# EAGLE design Logic (EAGLE 6.4)

## Sheet 1 of 9: Power Supply
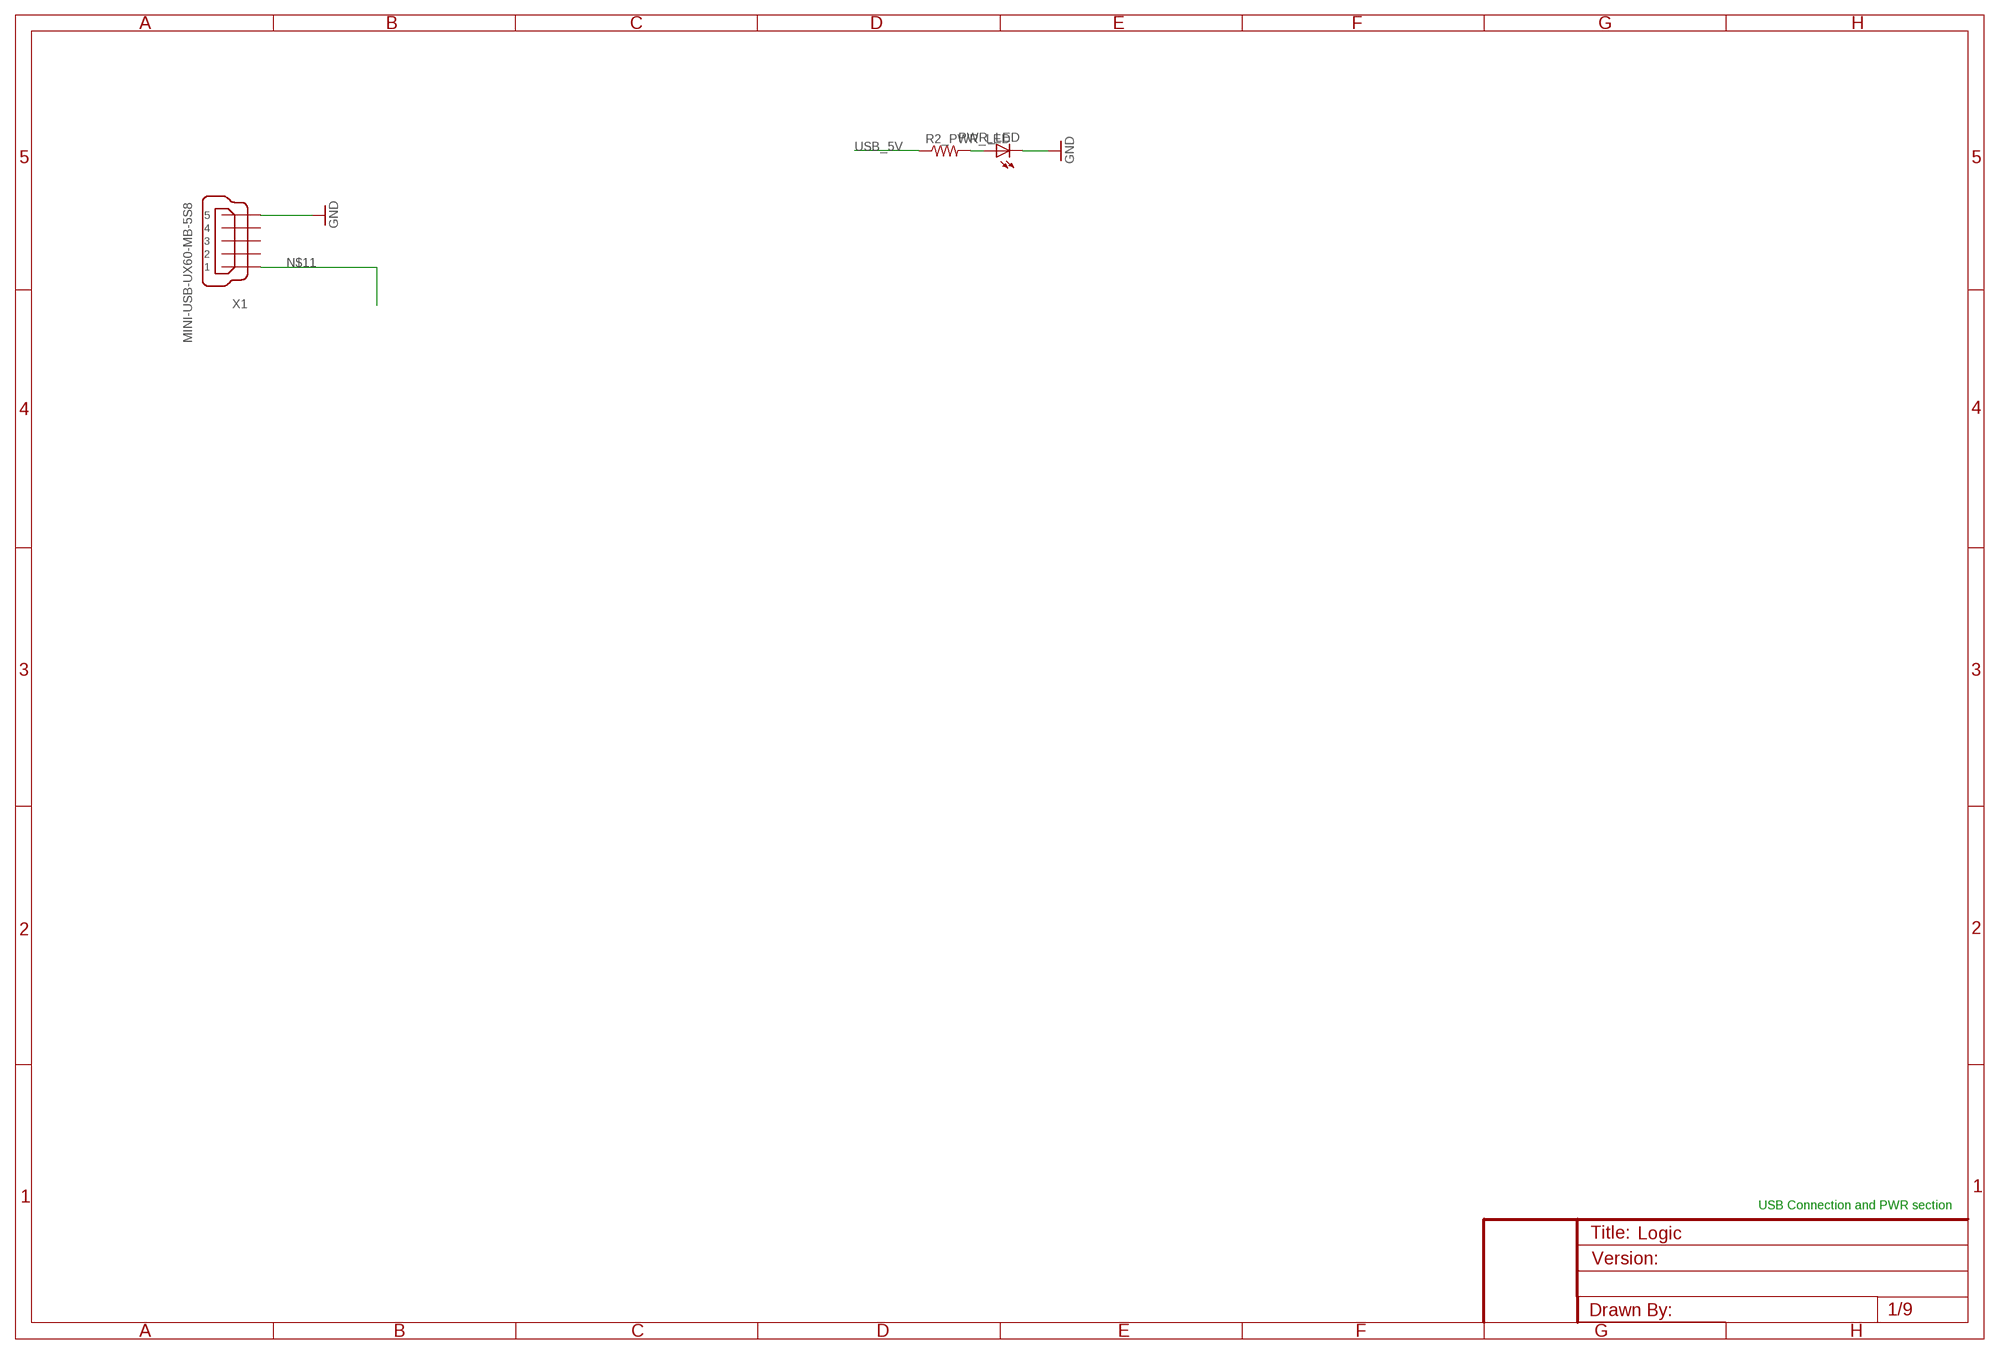
[diagram p0: schematic, sheet 1]

### Parts
PWR_LED  LEDCHIP-LED0603  [CHIP-LED0603]
R2_PWR_LED  RESISTOR0402-RES  [0402-RES]
X1  MINI-USB-UX60-MB-5S8  [UX60-MB-5S8]

### Nets
GND: PWR_LED.C X1.5 ; also sheet 2,4
N$1: PWR_LED.A R2_PWR_LED.2
N$11: X1.1
USB_5V: R2_PWR_LED.1
Unconnected: X1.2 X1.3 X1.4

### Notes on the sheet
- USB Connection and PWR section

## Sheet 2 of 9: STM32F439IIT
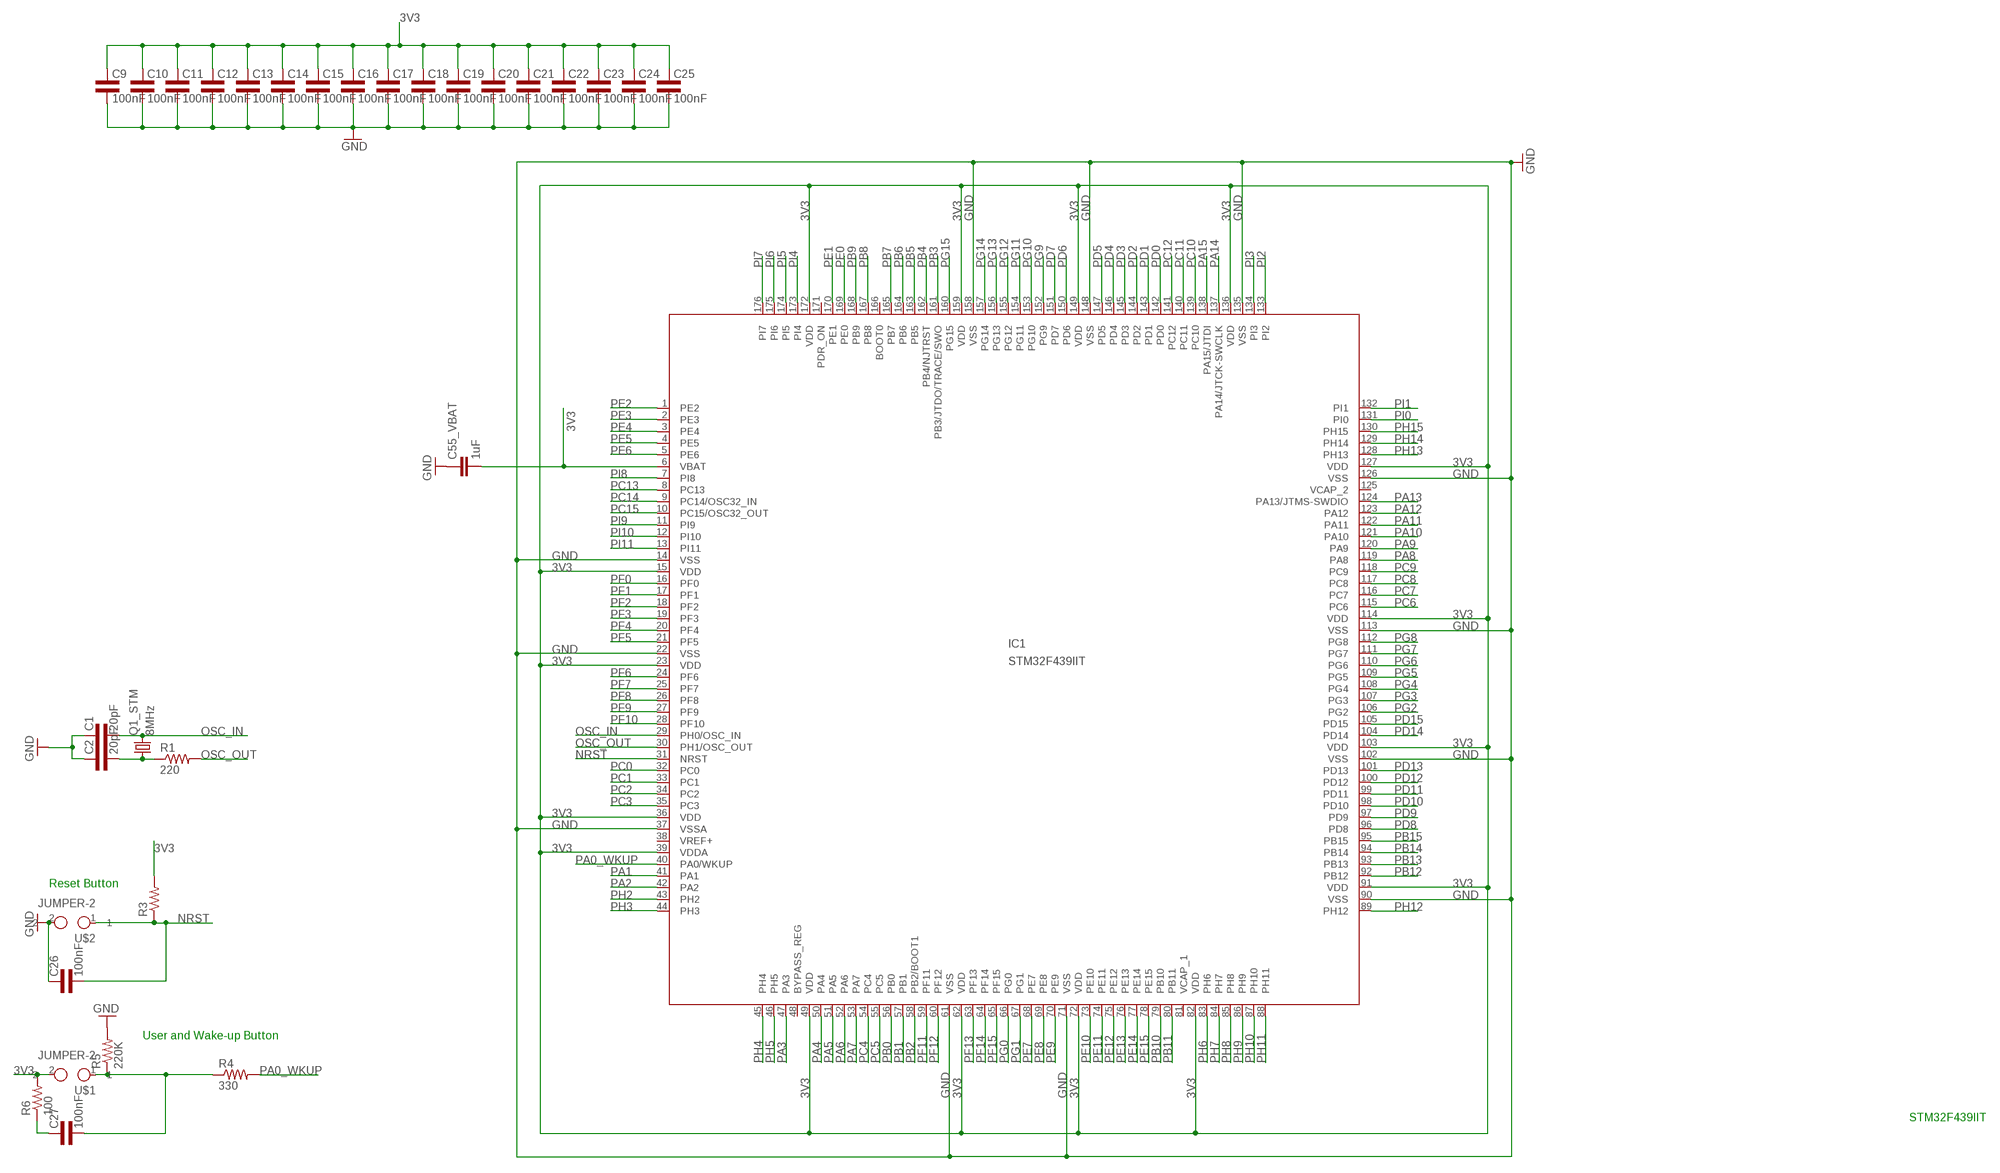
[diagram p1: schematic, sheet 2]

### Parts
C1  20pF  CAP0402L3  [0402L3]
C2  20pF  CAP0402L3  [0402L3]
C9  100nF  CAP0402L3  [0402L3]
C10  100nF  CAP0402L3  [0402L3]
C11  100nF  CAP0402L3  [0402L3]
C12  100nF  CAP0402L3  [0402L3]
C13  100nF  CAP0402L3  [0402L3]
C14  100nF  CAP0402L3  [0402L3]
C15  100nF  CAP0402L3  [0402L3]
C16  100nF  CAP0402L3  [0402L3]
C17  100nF  CAP0402L3  [0402L3]
C18  100nF  CAP0402L3  [0402L3]
C19  100nF  CAP0402L3  [0402L3]
C20  100nF  CAP0402L3  [0402L3]
C21  100nF  CAP0402L3  [0402L3]
C22  100nF  CAP0402L3  [0402L3]
C23  100nF  CAP0402L3  [0402L3]
C24  100nF  CAP0402L3  [0402L3]
C25  100nF  CAP0402L3  [0402L3]
C26  100nF  CAP0402L3  [0402L3]
C27  100nF  CAP0402L3  [0402L3]
C55_VBAT  1uF  C-EUC0402  [C0402]
IC1  STM32F439IIT  [LQFP-176]
Q1_STM  8MHz  CRYSTALCTS406  [CTS406]
R1  220  RESISTOR0402-RES  [0402-RES]
R3  RESISTOR0402-RES  [0402-RES]
R4  330  RESISTOR0402-RES  [0402-RES]
R5  220K  RESISTOR0402-RES  [0402-RES]
R6  100  RESISTOR0402-RES  [0402-RES]
U$1  JUMPER-2  [1X02]
U$2  JUMPER-2  [1X02]

### Nets
3V3: C9.P$1 C10.P$1 C11.P$1 C12.P$1 C13.P$1 C14.P$1 C15.P$1 C16.P$1 C17.P$1 C18.P$1 C19.P$1 C20.P$1 C21.P$1 C22.P$1 C23.P$1 C24.P$1 C25.P$1 C55_VBAT.2 IC1.6(VBAT) IC1.15(VDD) IC1.23(VDD) IC1.36(VDD) IC1.39(VDDA) IC1.49(VDD) IC1.62(VDD) IC1.72(VDD) IC1.82(VDD) IC1.91(VDD) IC1.103(VDD) IC1.114(VDD) IC1.127(VDD) IC1.136(VDD) IC1.149(VDD) IC1.159(VDD) IC1.172(VDD) R3.2 R6.2 U$1.2 ; also sheet 4
GND: C1.P$1 C2.P$1 C9.P$2 C10.P$2 C11.P$2 C12.P$2 C13.P$2 C14.P$2 C15.P$2 C16.P$2 C17.P$2 C18.P$2 C19.P$2 C20.P$2 C21.P$2 C22.P$2 C23.P$2 C24.P$2 C25.P$2 C26.P$1 C55_VBAT.1 IC1.14(VSS) IC1.22(VSS) IC1.37(VSSA) IC1.61(VSS) IC1.71(VSS) IC1.90(VSS) IC1.102(VSS) IC1.113(VSS) IC1.126(VSS) IC1.135(VSS) IC1.148(VSS) IC1.158(VSS) R5.2 U$2.2 ; also sheet 1,4
N$2: C2.P$2 Q1_STM.1 R1.1
N$3: C27.P$2 R4.1 R5.1 U$1.1
N$4: C27.P$1 R6.1
NRST: C26.P$2 IC1.31(NRST) R3.1 U$2.1
OSC_IN: C1.P$2 IC1.29(PH0/OSC_IN) Q1_STM.3
OSC_OUT: IC1.30(PH1/OSC_OUT) R1.2
PA0_WKUP: IC1.40(PA0/WKUP) R4.2
PA1: IC1.41(PA1)
PA2: IC1.42(PA2)
PA3: IC1.47(PA3)
PA4: IC1.50(PA4)
PA5: IC1.51(PA5)
PA6: IC1.52(PA6)
PA7: IC1.53(PA7)
PA8: IC1.119(PA8)
PA9: IC1.120(PA9)
PA10: IC1.121(PA10)
PA11: IC1.122(PA11)
PA12: IC1.123(PA12)
PA13: IC1.124(PA13/JTMS-SWDIO)
PA14: IC1.137(PA14/JTCK-SWCLK)
PA15: IC1.138(PA15/JTDI)
PB0: IC1.56(PB0)
PB1: IC1.57(PB1)
PB2: IC1.58(PB2/BOOT1)
PB3: IC1.161(PB3/JTDO/TRACE/SWO)
PB4: IC1.162(PB4/NJTRST)
PB5: IC1.163(PB5) ; also sheet 4
PB6: IC1.164(PB6) ; also sheet 4
PB7: IC1.165(PB7)
PB8: IC1.167(PB8)
PB9: IC1.168(PB9)
PB10: IC1.79(PB10)
PB11: IC1.80(PB11)
PB12: IC1.92(PB12)
PB13: IC1.93(PB13)
PB14: IC1.94(PB14)
PB15: IC1.95(PB15)
PC0: IC1.32(PC0) ; also sheet 4
PC1: IC1.33(PC1)
PC2: IC1.34(PC2)
PC3: IC1.35(PC3)
PC4: IC1.54(PC4)
PC5: IC1.55(PC5)
PC6: IC1.115(PC6)
PC7: IC1.116(PC7)
PC8: IC1.117(PC8)
PC9: IC1.118(PC9)
PC10: IC1.139(PC10)
PC11: IC1.140(PC11)
PC12: IC1.141(PC12)
PC13: IC1.8(PC13)
PC14: IC1.9(PC14/OSC32_IN)
PC15: IC1.10(PC15/OSC32_OUT)
PD0: IC1.142(PD0) ; also sheet 4
PD1: IC1.143(PD1) ; also sheet 4
PD2: IC1.144(PD2)
PD3: IC1.145(PD3)
PD4: IC1.146(PD4)
PD5: IC1.147(PD5)
PD6: IC1.150(PD6)
PD7: IC1.151(PD7)
PD8: IC1.96(PD8) ; also sheet 4
PD9: IC1.97(PD9) ; also sheet 4
PD10: IC1.98(PD10) ; also sheet 4
PD11: IC1.99(PD11)
PD12: IC1.100(PD12)
PD13: IC1.101(PD13)
PD14: IC1.104(PD14) ; also sheet 4
PD15: IC1.105(PD15) ; also sheet 4
PE0: IC1.169(PE0) ; also sheet 4
PE1: IC1.170(PE1) ; also sheet 4
PE2: IC1.1(PE2)
PE3: IC1.2(PE3)
PE4: IC1.3(PE4)
PE5: IC1.4(PE5)
PE6: IC1.5(PE6)
PE7: IC1.68(PE7) ; also sheet 4
PE8: IC1.69(PE8) ; also sheet 4
PE9: IC1.70(PE9) ; also sheet 4
PE10: IC1.73(PE10) ; also sheet 4
PE11: IC1.74(PE11) ; also sheet 4
PE12: IC1.75(PE12) ; also sheet 4
PE13: IC1.76(PE13) ; also sheet 4
PE14: IC1.77(PE14) ; also sheet 4
PE15: IC1.78(PE15) ; also sheet 4
PF0: IC1.16(PF0) ; also sheet 4
PF1: IC1.17(PF1) ; also sheet 4
PF2: IC1.18(PF2) ; also sheet 4
PF3: IC1.19(PF3) ; also sheet 4
PF4: IC1.20(PF4) ; also sheet 4
PF5: IC1.21(PF5) ; also sheet 4
PF6: IC1.24(PF6)
PF7: IC1.25(PF7)
PF8: IC1.26(PF8)
PF9: IC1.27(PF9)
PF10: IC1.28(PF10)
PF11: IC1.59(PF11) ; also sheet 4
PF12: IC1.60(PF12) ; also sheet 4
PF13: IC1.63(PF13) ; also sheet 4
PF14: IC1.64(PF14) ; also sheet 4
PF15: IC1.65(PF15) ; also sheet 4
PG0: IC1.66(PG0) ; also sheet 4
PG1: IC1.67(PG1) ; also sheet 4
PG2: IC1.106(PG2)
PG3: IC1.107(PG3)
PG4: IC1.108(PG4) ; also sheet 4
PG5: IC1.109(PG5) ; also sheet 4
PG6: IC1.110(PG6)
PG7: IC1.111(PG7)
PG8: IC1.112(PG8) ; also sheet 4
PG9: IC1.152(PG9)
PG10: IC1.153(PG10)
PG11: IC1.154(PG11)
PG12: IC1.155(PG12)
PG13: IC1.156(PG13)
PG14: IC1.157(PG14)
PG15: IC1.160(PG15) ; also sheet 4
PH2: IC1.43(PH2)
PH3: IC1.44(PH3)
PH4: IC1.45(PH4)
PH5: IC1.46(PH5)
PH6: IC1.83(PH6)
PH7: IC1.84(PH7)
PH8: IC1.85(PH8)
PH9: IC1.86(PH9)
PH10: IC1.87(PH10)
PH11: IC1.88(PH11)
PH12: IC1.89(PH12)
PH13: IC1.128(PH13)
PH14: IC1.129(PH14)
PH15: IC1.130(PH15)
PI0: IC1.131(PI0)
PI1: IC1.132(PI1)
PI2: IC1.133(PI2)
PI3: IC1.134(PI3)
PI4: IC1.173(PI4)
PI5: IC1.174(PI5)
PI6: IC1.175(PI6)
PI7: IC1.176(PI7)
PI8: IC1.7(PI8)
PI9: IC1.11(PI9)
PI10: IC1.12(PI10)
PI11: IC1.13(PI11)
Unconnected: IC1.48(BYPASS_REG) IC1.166(BOOT0)

### Notes on the sheet
- Reset Button
- User and Wake-up Button
- STM32F439IIT

## Sheet 3 of 9: Header Pins
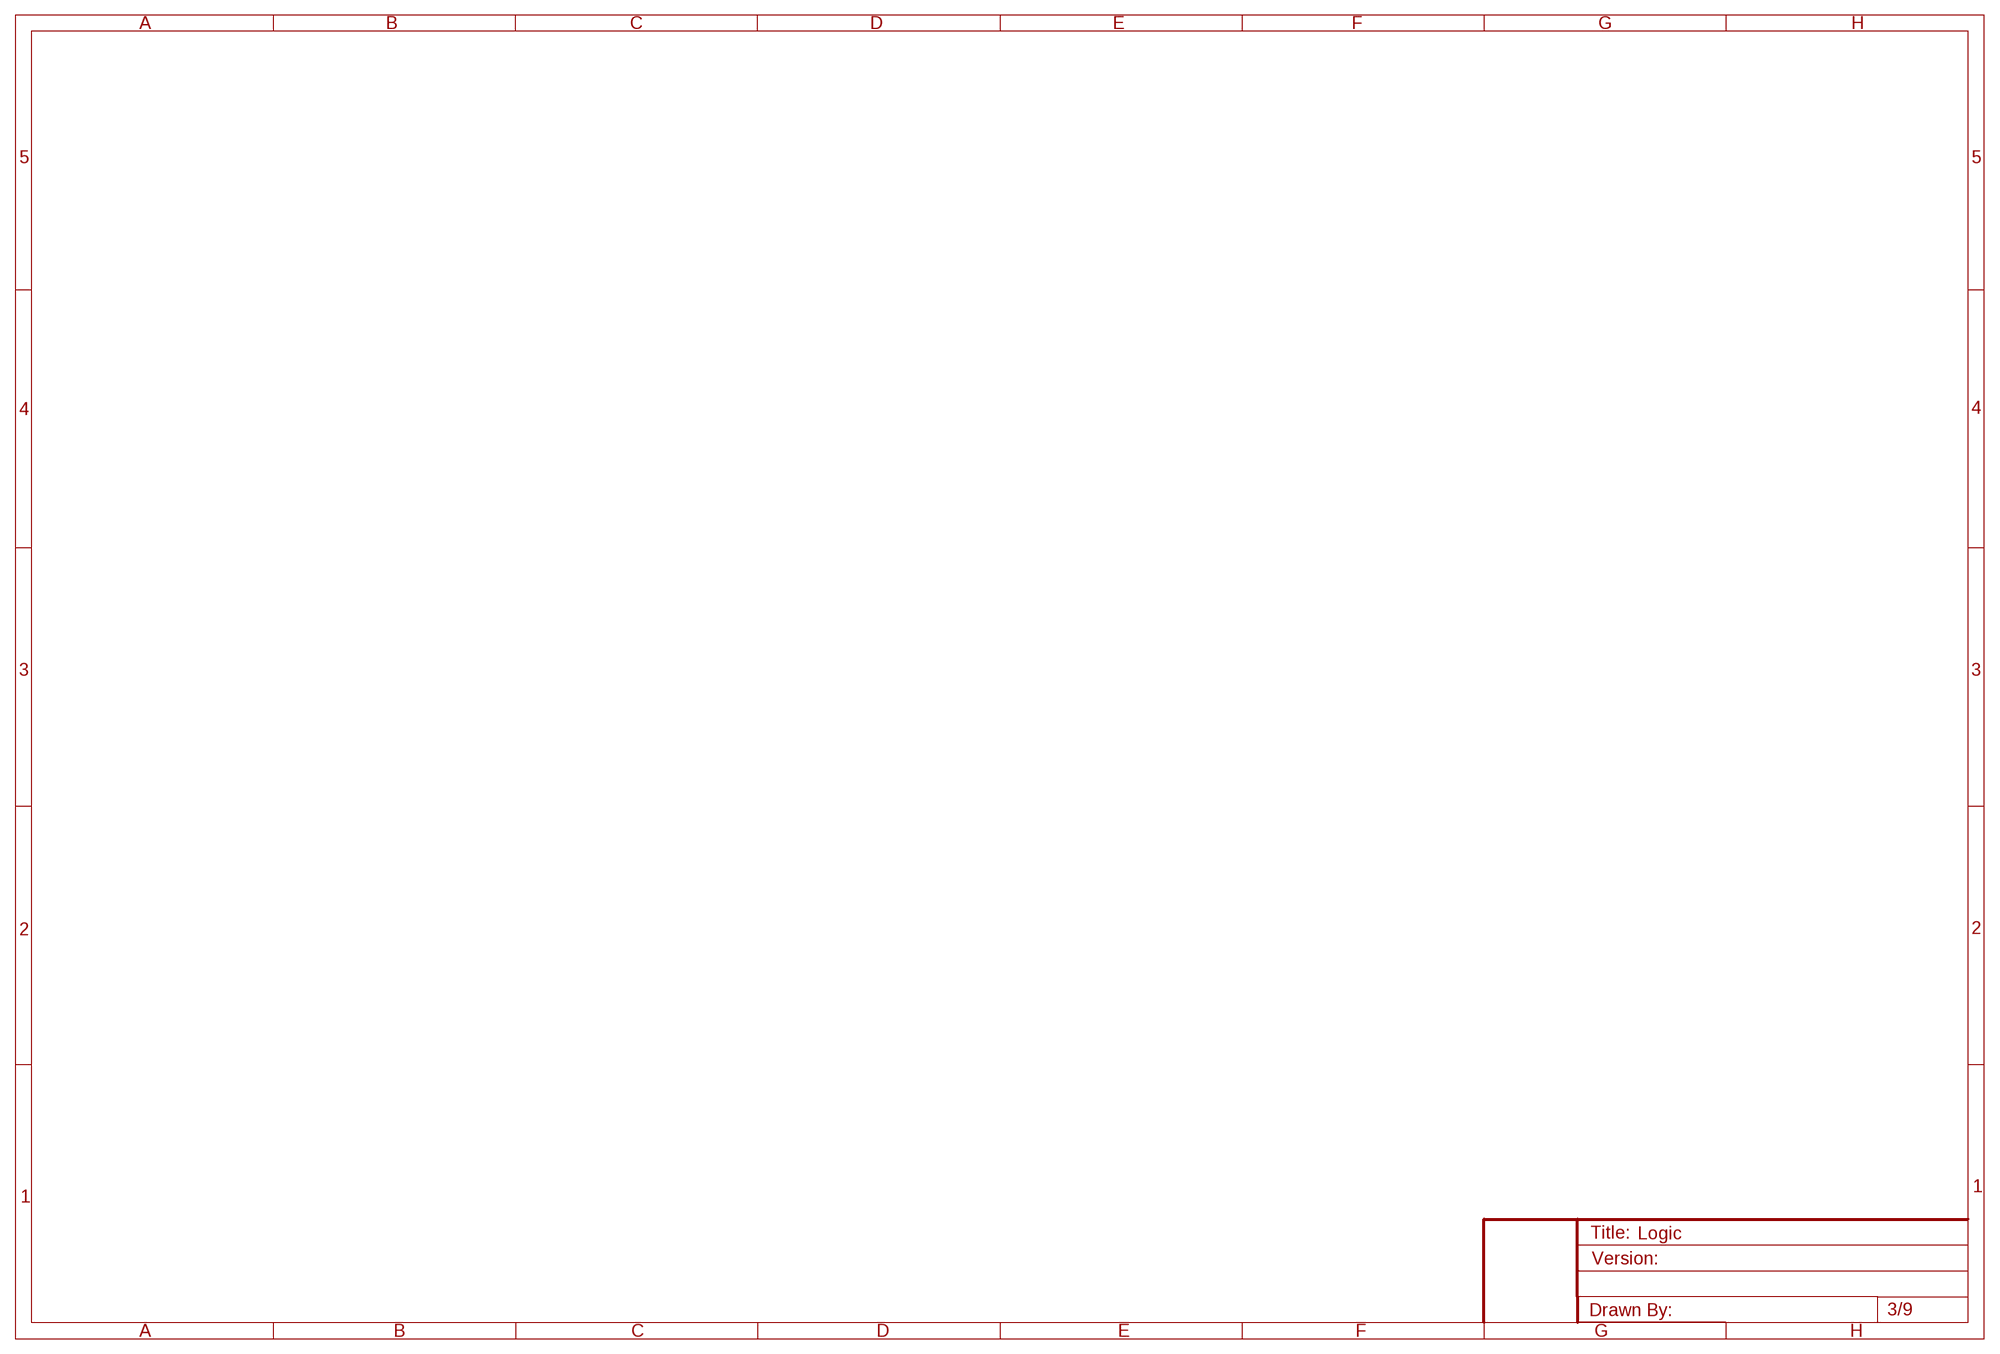
[diagram p2: schematic, sheet 3]

## Sheet 4 of 9: SRAM
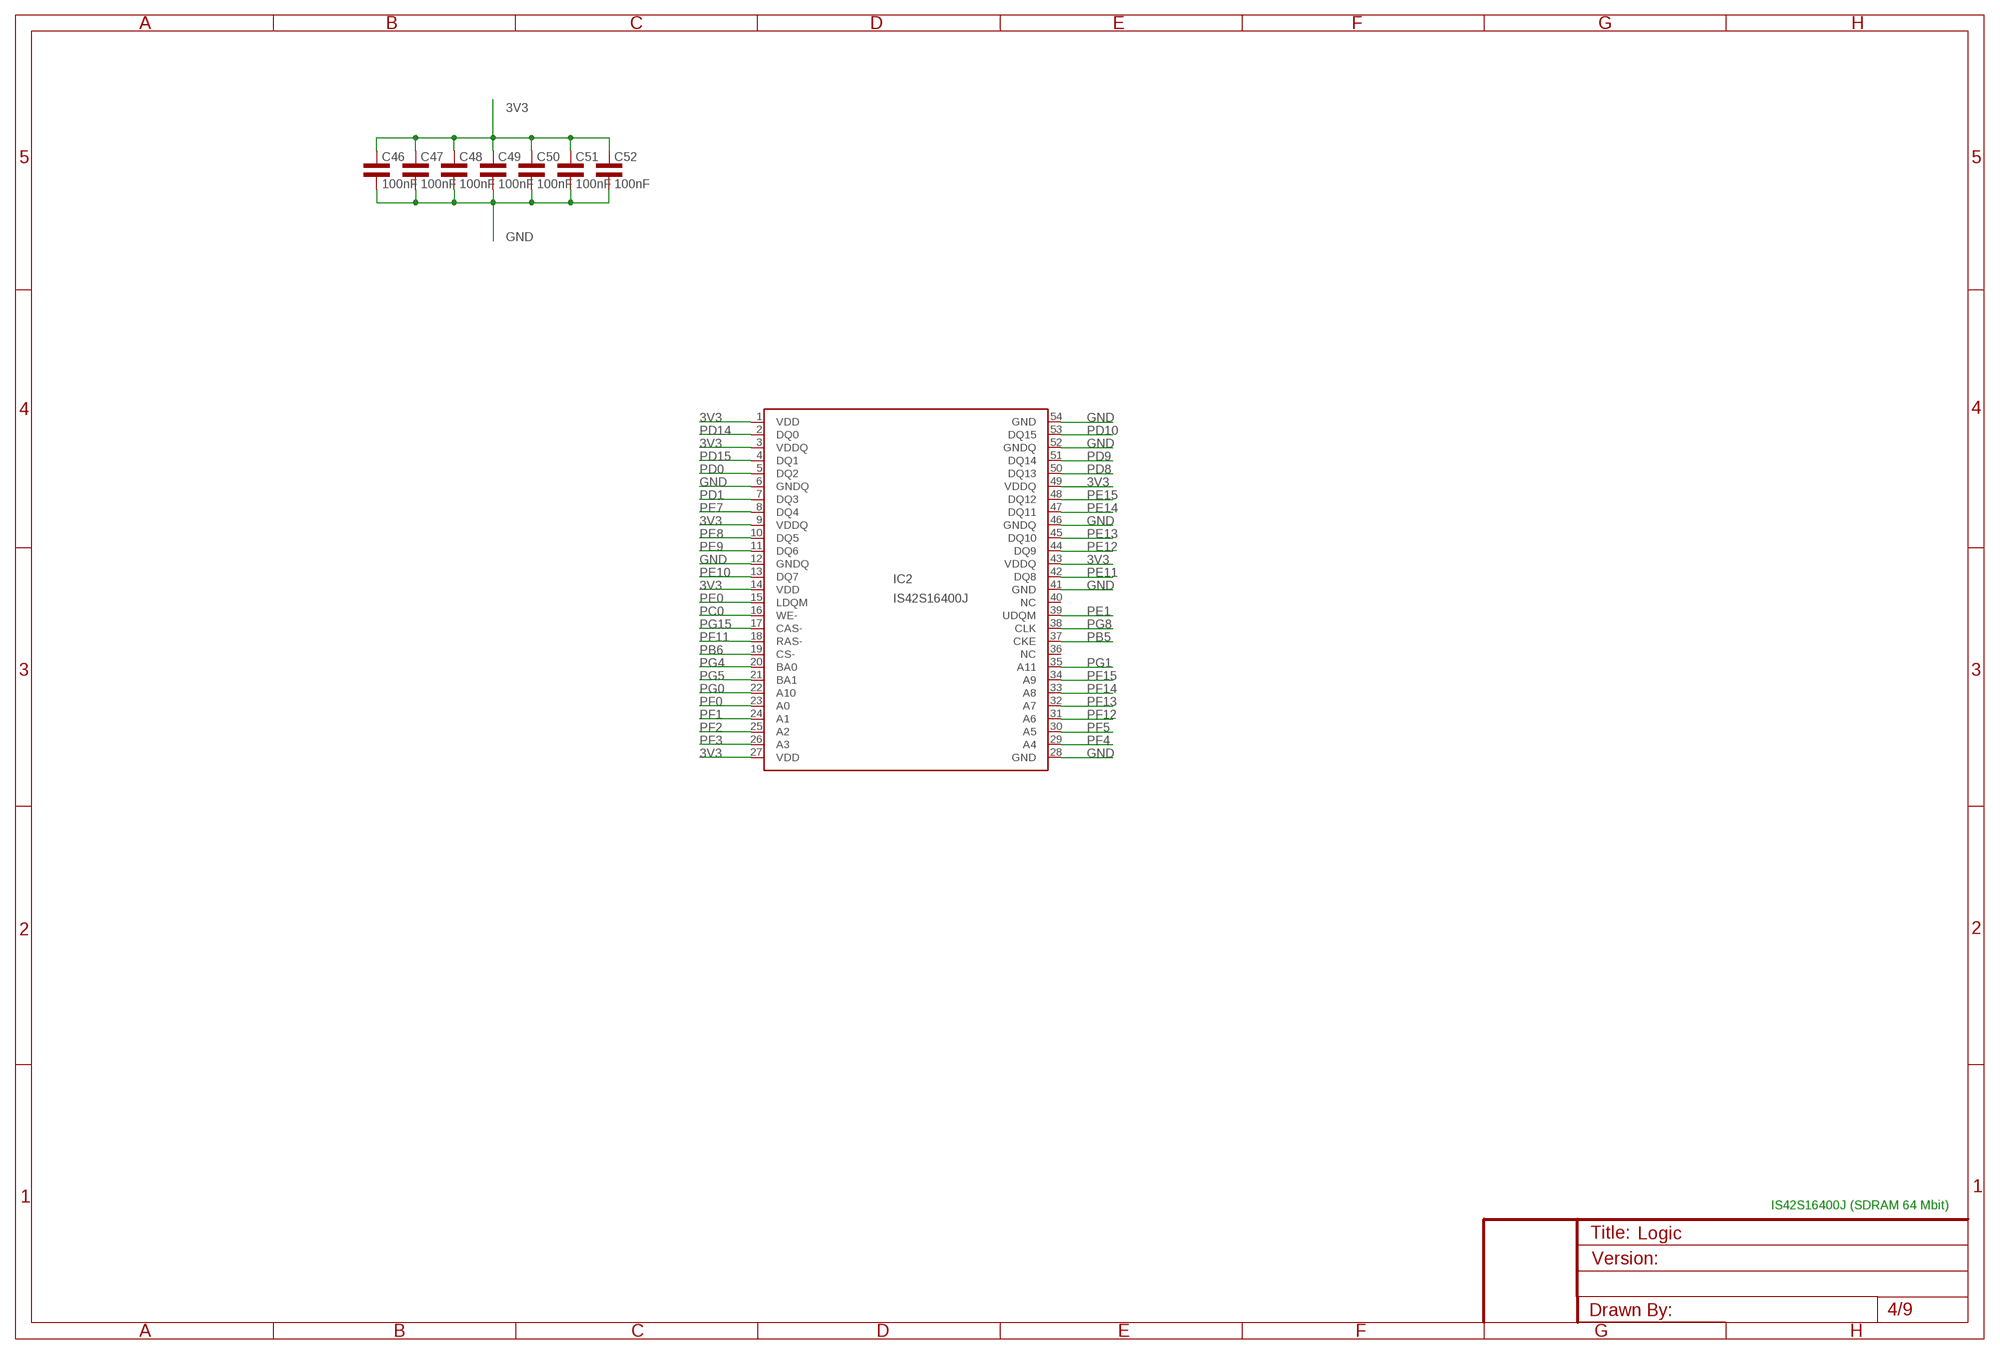
[diagram p3: schematic, sheet 4]

### Parts
C46  100nF  CAP0402L3  [0402L3]
C47  100nF  CAP0402L3  [0402L3]
C48  100nF  CAP0402L3  [0402L3]
C49  100nF  CAP0402L3  [0402L3]
C50  100nF  CAP0402L3  [0402L3]
C51  100nF  CAP0402L3  [0402L3]
C52  100nF  CAP0402L3  [0402L3]
IC2  IS42S16400J  [TSOP-2]

### Nets
3V3: C46.P$1 C47.P$1 C48.P$1 C49.P$1 C50.P$1 C51.P$1 C52.P$1 IC2.1(VDD) IC2.3(VDDQ) IC2.9(VDDQ) IC2.14(VDD) IC2.27(VDD) IC2.43(VDDQ) IC2.49(VDDQ) ; also sheet 2
GND: C46.P$2 C47.P$2 C48.P$2 C49.P$2 C50.P$2 C51.P$2 C52.P$2 IC2.6(GNDQ) IC2.12(GNDQ) IC2.28(GND) IC2.41(GND) IC2.46(GNDQ) IC2.52(GNDQ) IC2.54(GND) ; also sheet 1,2
PB5: IC2.37(CKE) ; also sheet 2
PB6: IC2.19(CS-) ; also sheet 2
PC0: IC2.16(WE-) ; also sheet 2
PD0: IC2.5(DQ2) ; also sheet 2
PD1: IC2.7(DQ3) ; also sheet 2
PD8: IC2.50(DQ13) ; also sheet 2
PD9: IC2.51(DQ14) ; also sheet 2
PD10: IC2.53(DQ15) ; also sheet 2
PD14: IC2.2(DQ0) ; also sheet 2
PD15: IC2.4(DQ1) ; also sheet 2
PE0: IC2.15(LDQM) ; also sheet 2
PE1: IC2.39(UDQM) ; also sheet 2
PE7: IC2.8(DQ4) ; also sheet 2
PE8: IC2.10(DQ5) ; also sheet 2
PE9: IC2.11(DQ6) ; also sheet 2
PE10: IC2.13(DQ7) ; also sheet 2
PE11: IC2.42(DQ8) ; also sheet 2
PE12: IC2.44(DQ9) ; also sheet 2
PE13: IC2.45(DQ10) ; also sheet 2
PE14: IC2.47(DQ11) ; also sheet 2
PE15: IC2.48(DQ12) ; also sheet 2
PF0: IC2.23(A0) ; also sheet 2
PF1: IC2.24(A1) ; also sheet 2
PF2: IC2.25(A2) ; also sheet 2
PF3: IC2.26(A3) ; also sheet 2
PF4: IC2.29(A4) ; also sheet 2
PF5: IC2.30(A5) ; also sheet 2
PF11: IC2.18(RAS-) ; also sheet 2
PF12: IC2.31(A6) ; also sheet 2
PF13: IC2.32(A7) ; also sheet 2
PF14: IC2.33(A8) ; also sheet 2
PF15: IC2.34(A9) ; also sheet 2
PG0: IC2.22(A10) ; also sheet 2
PG1: IC2.35(A11) ; also sheet 2
PG4: IC2.20(BA0) ; also sheet 2
PG5: IC2.21(BA1) ; also sheet 2
PG8: IC2.38(CLK) ; also sheet 2
PG15: IC2.17(CAS-) ; also sheet 2
Unconnected: IC2.36(NC) IC2.40(NC)

### Notes on the sheet
- IS42S16400J (SDRAM 64 Mbit)

## Sheet 5 of 9: TFT & Touch
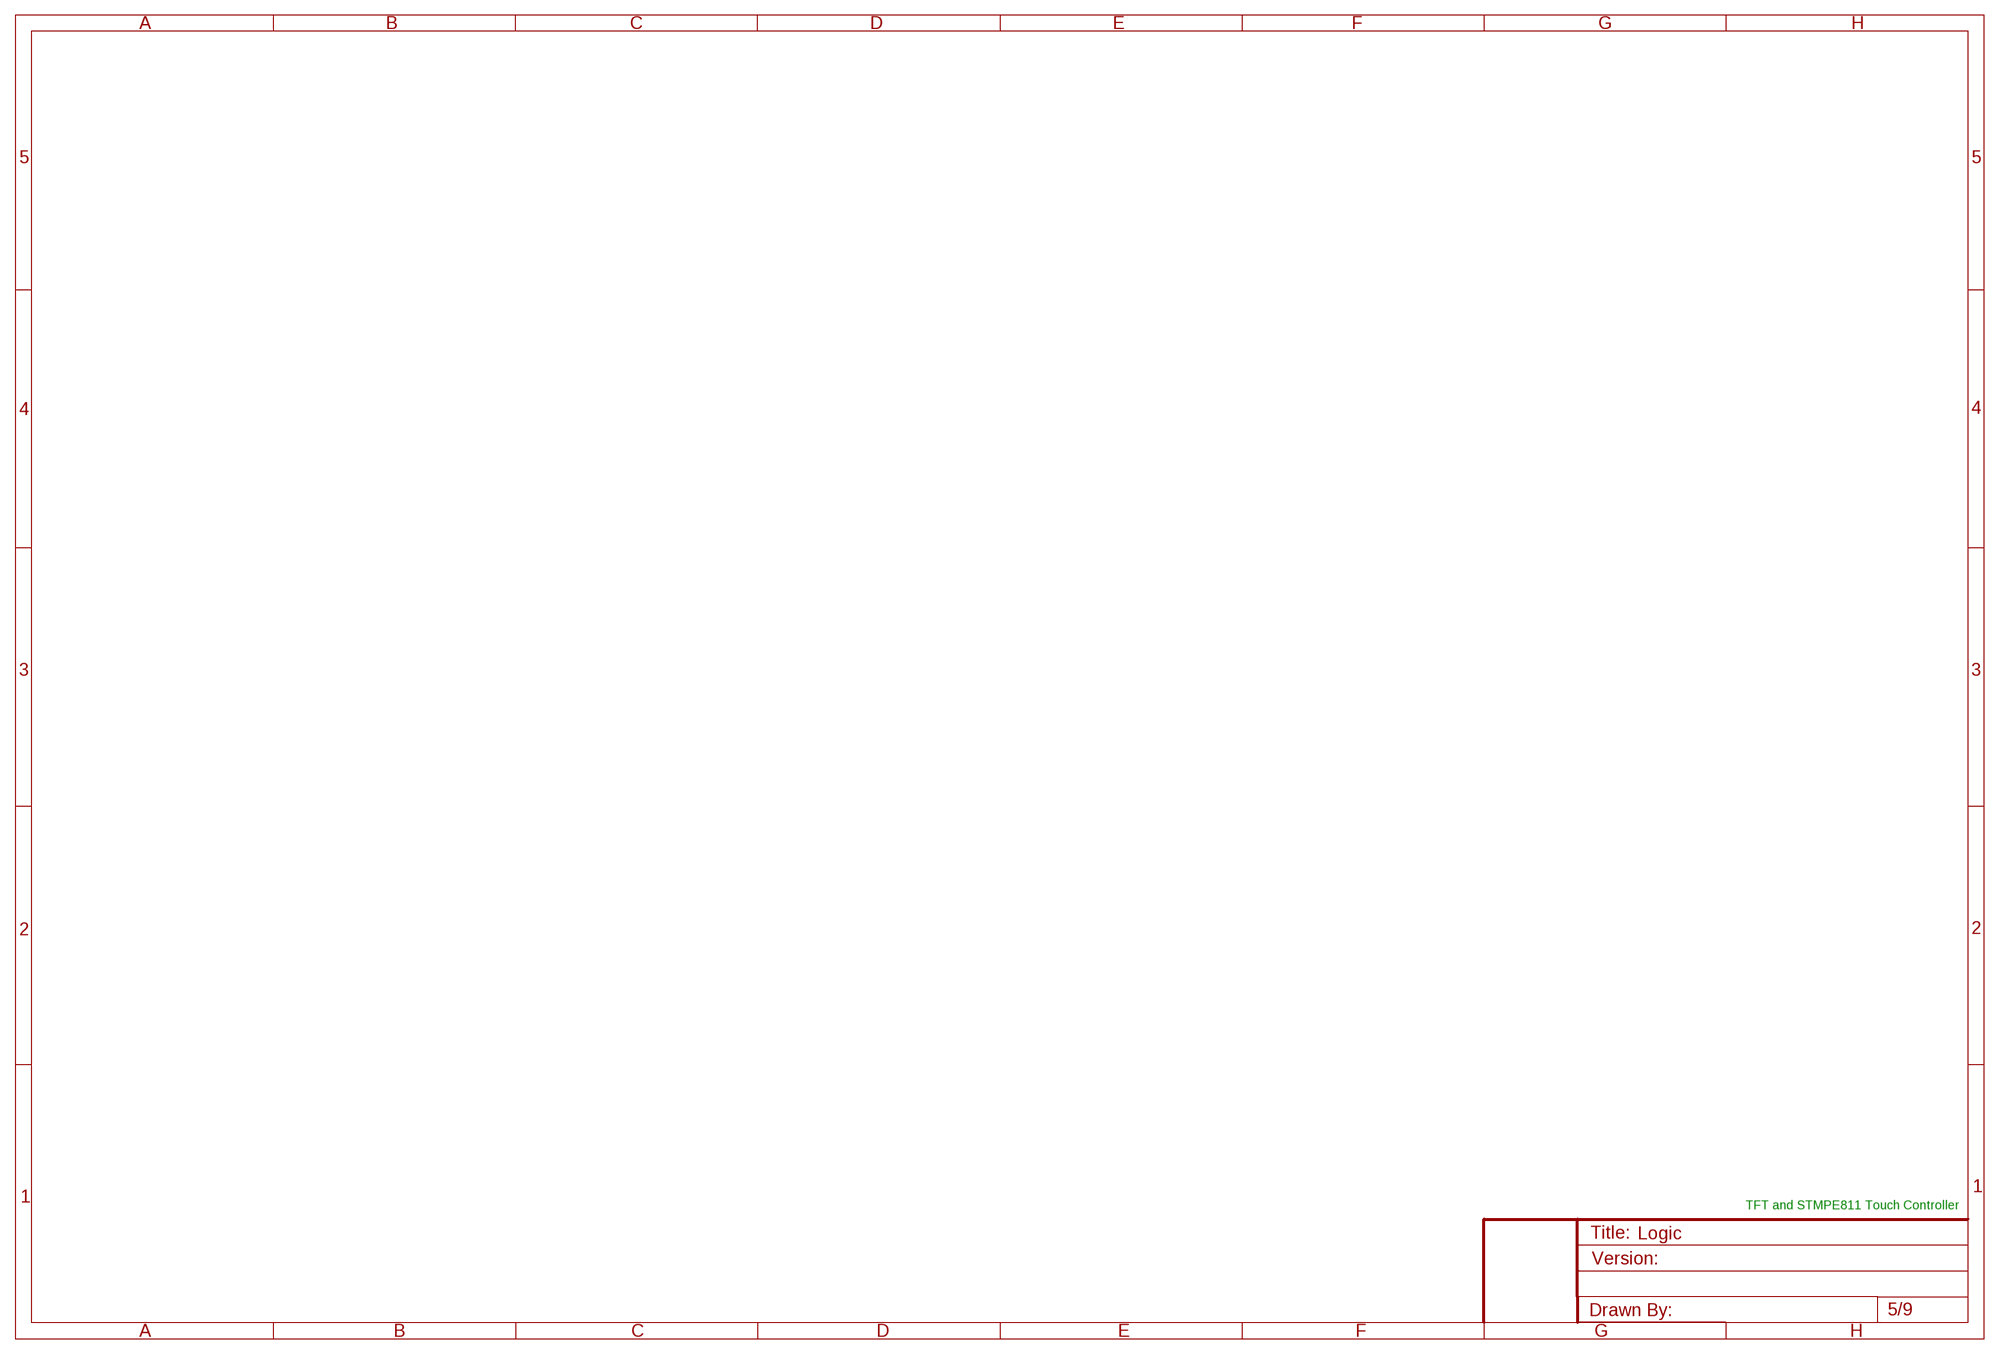
[diagram p4: schematic, sheet 5]

### Notes on the sheet
- TFT and STMPE811 Touch Controller

## Sheet 6 of 9: MP3 Codec
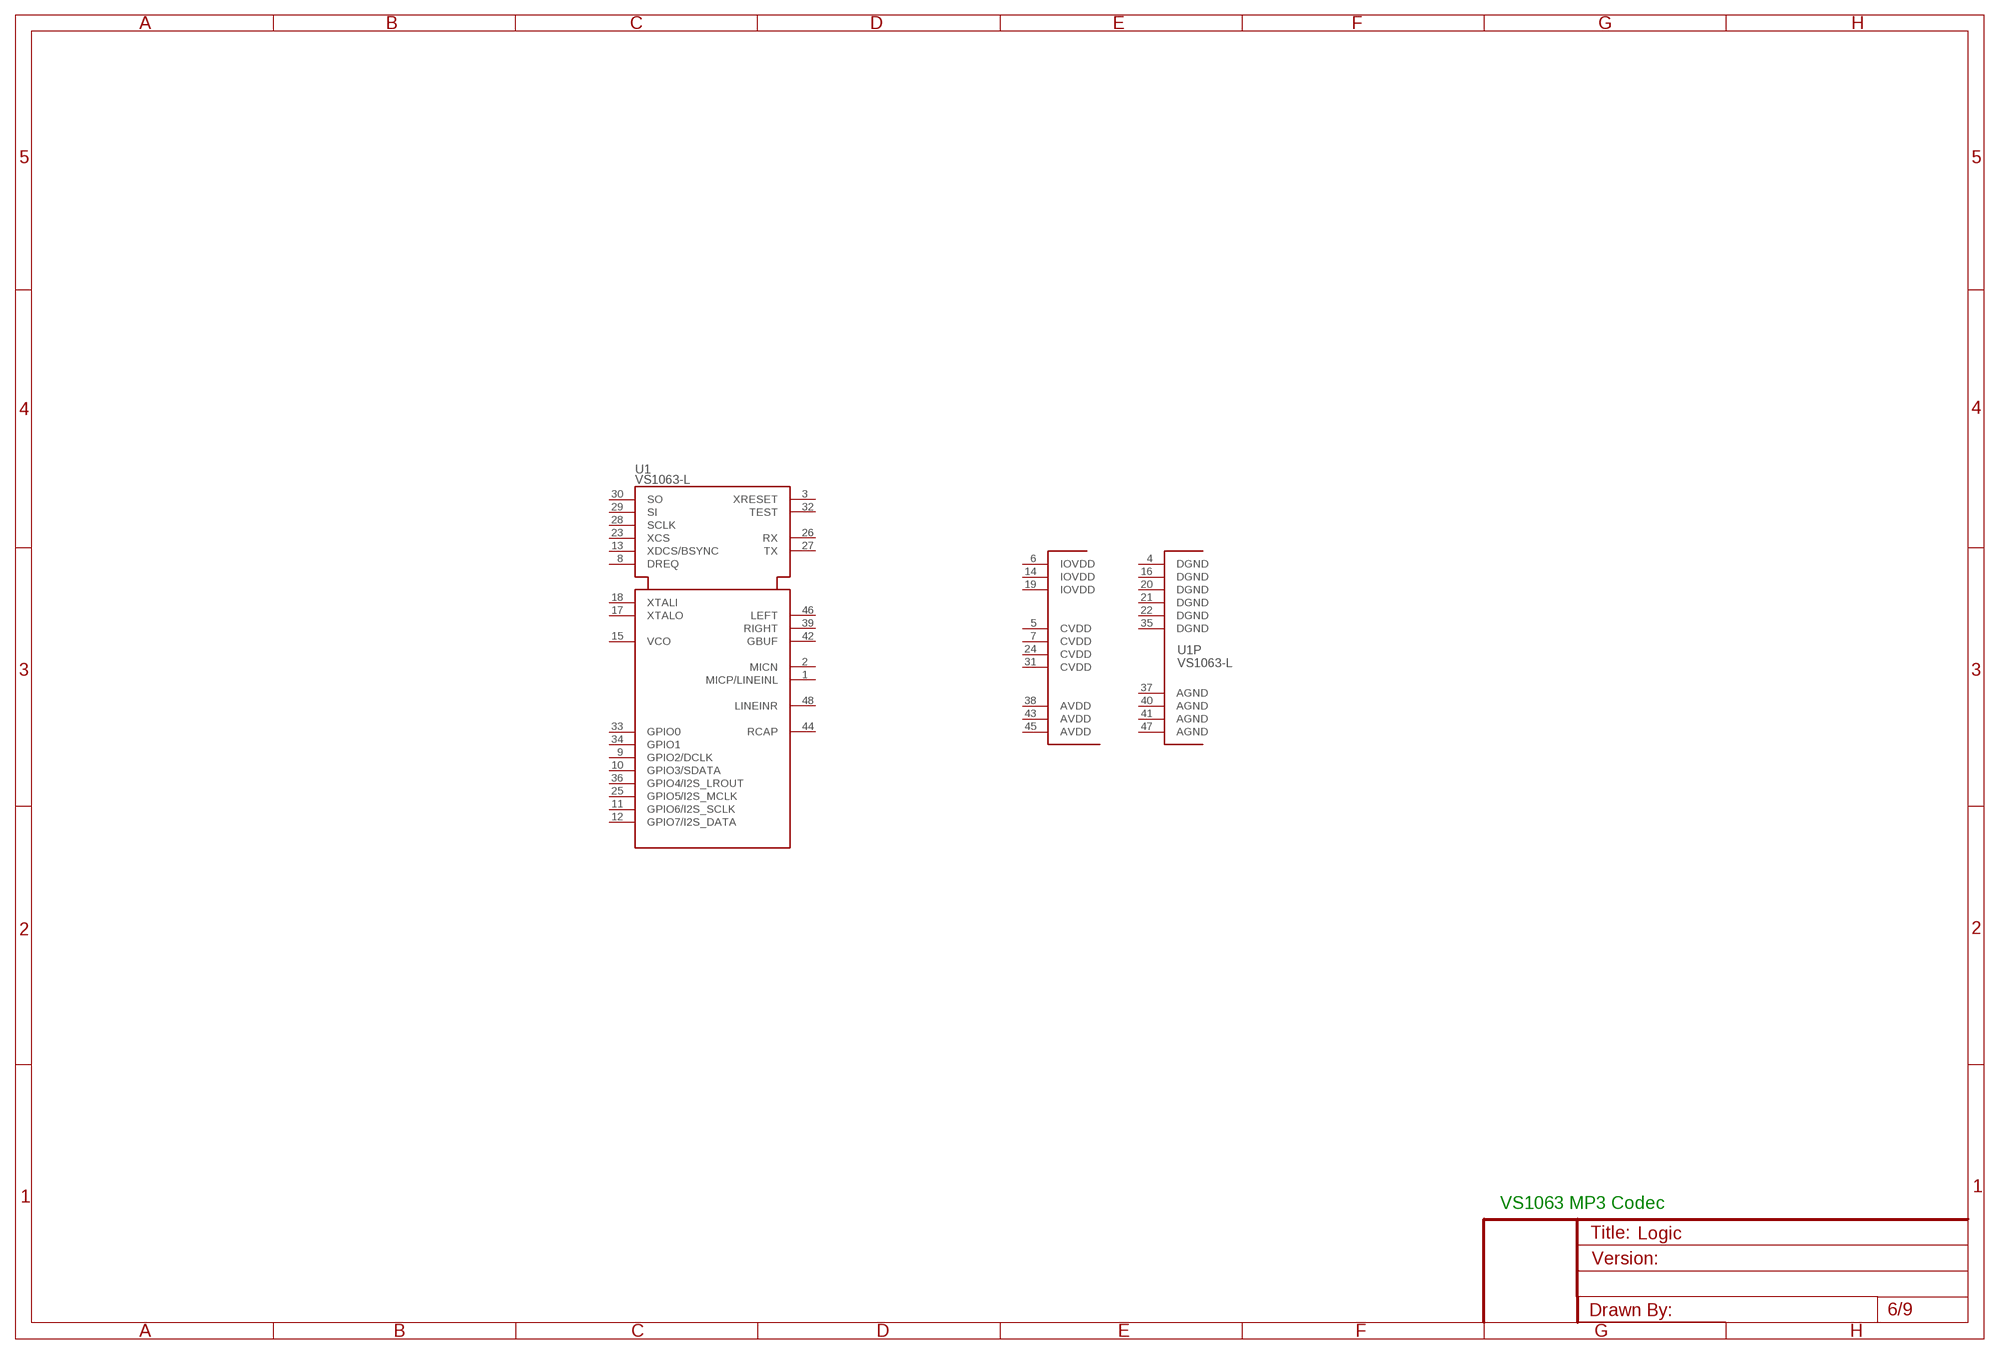
[diagram p5: schematic, sheet 6]

### Parts
U1  VS1063-L  [LQFP48]
Unconnected: U1.1(MICP/LINEINL) U1.2(MICN) U1.3(XRESET) U1.8(DREQ) U1.9(GPIO2/DCLK) U1.10(GPIO3/SDATA) U1.11(GPIO6/I2S_SCLK) U1.12(GPIO7/I2S_DATA) U1.13(XDCS/BSYNC) U1.15(VCO) U1.17(XTALO) U1.18(XTALI) U1.23(XCS) U1.25(GPIO5/I2S_MCLK) U1.26(RX) U1.27(TX) U1.28(SCLK) U1.29(SI) U1.30(SO) U1.32(TEST) U1.33(GPIO0) U1.34(GPIO1) U1.36(GPIO4/I2S_LROUT) U1.39(RIGHT) U1.42(GBUF) U1.44(RCAP) U1.46(LEFT) U1.48(LINEINR)

### Notes on the sheet
- VS1063 MP3 Codec

## Sheet 7 of 9: USB to PCM

## Sheet 8 of 9: DAC

## Sheet 9 of 9

## Power pins joined to a net without a drawn wire
AGND: U1.37(AGND) U1.40(AGND) U1.41(AGND) U1.47(AGND)
AVDD: U1.38(AVDD) U1.43(AVDD) U1.45(AVDD)
CVDD: U1.5(CVDD) U1.7(CVDD) U1.24(CVDD) U1.31(CVDD)
DGND: U1.4(DGND) U1.16(DGND) U1.20(DGND) U1.21(DGND) U1.22(DGND) U1.35(DGND)
IOVDD: U1.6(IOVDD) U1.14(IOVDD) U1.19(IOVDD)
PDR_ON: IC1.171(PDR_ON)
VCAP_1: IC1.81(VCAP_1)
VCAP_2: IC1.125(VCAP_2)
VREF+: IC1.38(VREF+)

## Library data of the parts
C1 C2 C9-C27 C46-C52 = common:CAP
C55_VBAT = rcl:C-EU: CAPACITOR, European symbol
IC1 = STM32F439IIT:STM32F439IIT: edit this description Auto generated by make-symbol-device-package-bsdl.ulp Rev. 43 Source:
IC2 = IS42S16400J:IS42S16400J: edit this description Auto generated by make-symbol-device-package-bsdl.ulp Rev. 43 Source:
PWR_LED = led:LED: LED OSRAM: - CHIPLED LG R971, LG N971, LY N971, LG Q971, LY Q971, LO R971, LY R971 LH N974, LH R974 LS Q976, LO Q976, LY Q976 LO Q996 - Hyper CHIPLED LW Q18S LB Q993, LB Q99A, LB R99A - SideLED LS A670, LO A670, LY A670, LG A670, LP A670 LB A673, LV A673, LT A673, LW A673 LH A674 LY A675 LS A676, LA A676, LO A676, LY A676, LW A676 LS A679, LY A679, LG A679 - Hyper Micro SIDELED® LS Y876, LA Y876, LO Y876, LY Y876 LT Y87S - SmartLED LW L88C, LW L88S LB L89C, LB L89S, LG L890 LS L89K, LO L89K, LY L89K LS L896, LA L896, LO L896, LY L896 - TOPLED LS T670, LO T670, LY T670, LG T670, LP T670 LSG T670, LSP T670, LSY T670, LOP T670, LYG T670 LG T671, LOG T671, LSG T671 LB T673, LV T673, LT T673, LW T673 LH T674 LS T676, LA T676, LO T676, LY T676, LB T676, LH T676, LSB T676, LW T676 LB T67C, LV T67C, LT T67C, LS T67K, LO T67K, LY T67K, LW E67C LS E67B, LA E67B, LO E67B, LY E67B, LB E67C, LV E67C, LT E67C LW T67C LS T679, LY T679, LG T679 LS T770, LO T770, LY T770, LG T770, LP T770 LB T773, LV T773, LT T773, LW T773 LH T774 LS E675, LA E675, LY E675, LS T675 LS T776, LA T776, LO T776, LY T776, LB T776 LHGB T686 LT T68C, LB T68C - Hyper Mini TOPLED® LB M676 - Mini TOPLED Santana® LG M470 LS M47K, LO M47K, LY M47K Source: http://www.osram.convergy.de LUXEON: - LUMILED® LXK2-PW12-R00, LXK2-PW12-S00, LXK2-PW14-U00, LXK2-PW14-V00 LXK2-PM12-R00, LXK2-PM12-S00, LXK2-PM14-U00 LXK2-PE12-Q00, LXK2-PE12-R00, LXK2-PE12-S00, LXK2-PE14-T00, LXK2-PE14-U00 LXK2-PB12-K00, LXK2-PB12-L00, LXK2-PB12-M00, LXK2-PB14-N00, LXK2-PB14-P00, LXK2-PB14-Q00 LXK2-PR12-L00, LXK2-PR12-M00, LXK2-PR14-Q00, LXK2-PR14-R00 LXK2-PD12-Q00, LXK2-PD12-R00, LXK2-PD12-S00 LXK2-PH12-R00, LXK2-PH12-S00 LXK2-PL12-P00, LXK2-PL12-Q00, LXK2-PL12-R00 Source: www.luxeon.com KINGBRIGHT: KA-3528ASYC Source: www.kingbright.com
Q1_STM = crystal:CRYSTAL: CRYSTAL; OC_FARNELL: unknown; OC_NEWARK: unknown
R1 R2_PWR_LED R3-R6 = SparkFun-Passives:RESISTOR: Resistor Basic schematic elements and footprints for 0603, 1206, and PTH resistors.
U1 = vlsi-web:VS1063: MP3 / OGG / AAC / WMA / FLAC / G.711 / G.722 Audio Codec
U$1 U$2 = pinhead:JUMPER-2
X1 = con-hirose:MINI-USB-: MINI USB Connector Source: http://www.hirose.co.jp/cataloge_hp/e24000019.pdf; OC_FARNELL: unknown; OC_NEWARK: unknown

## Board
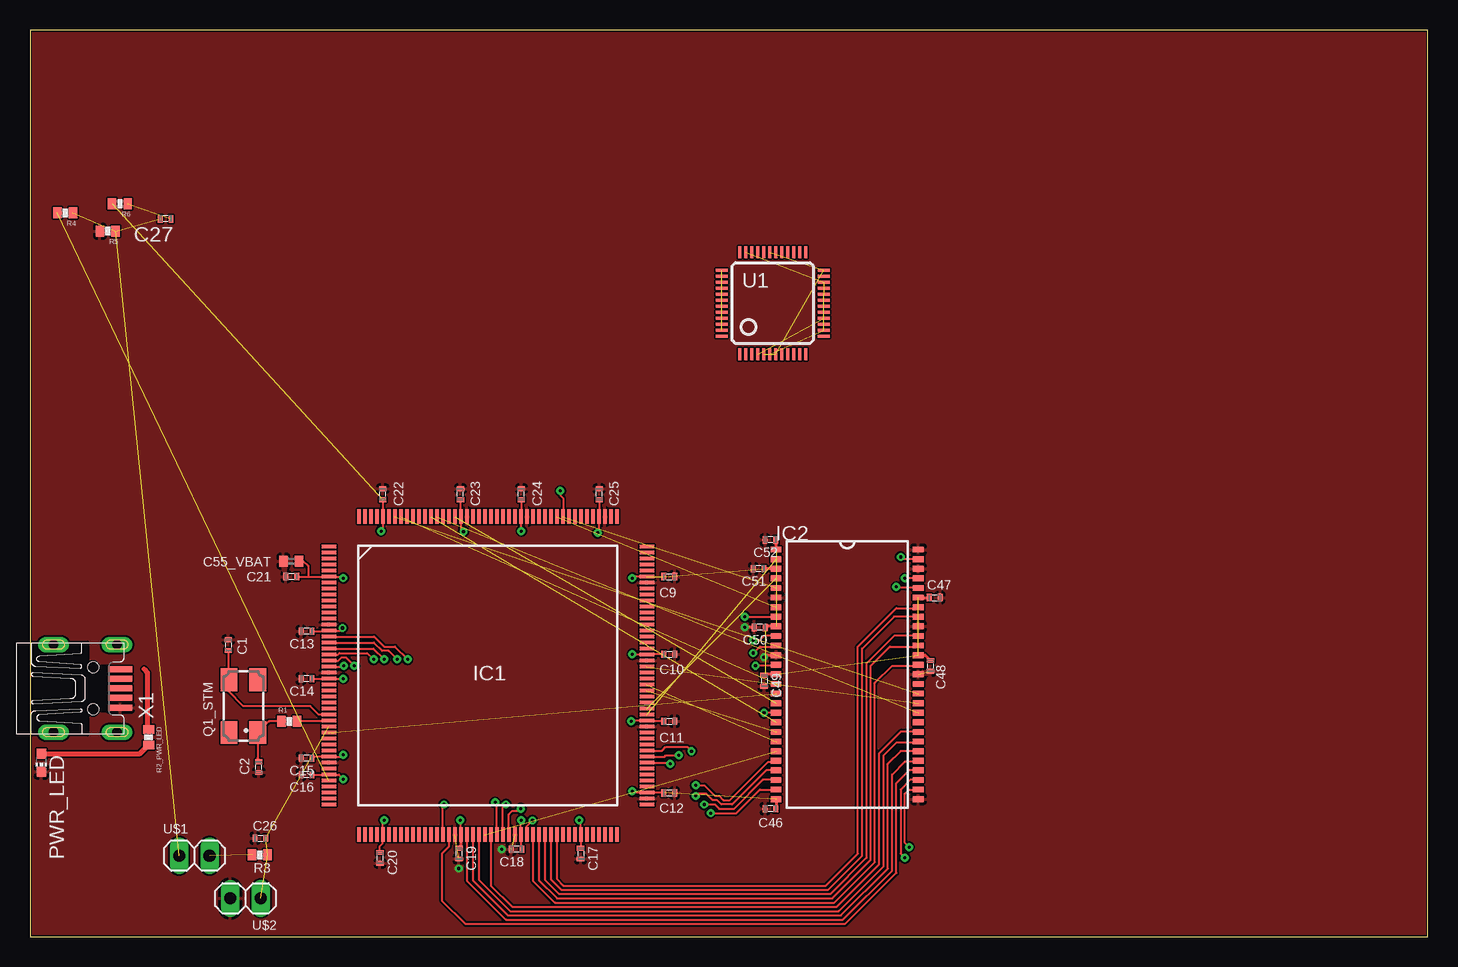
[diagram p6: board, top side]
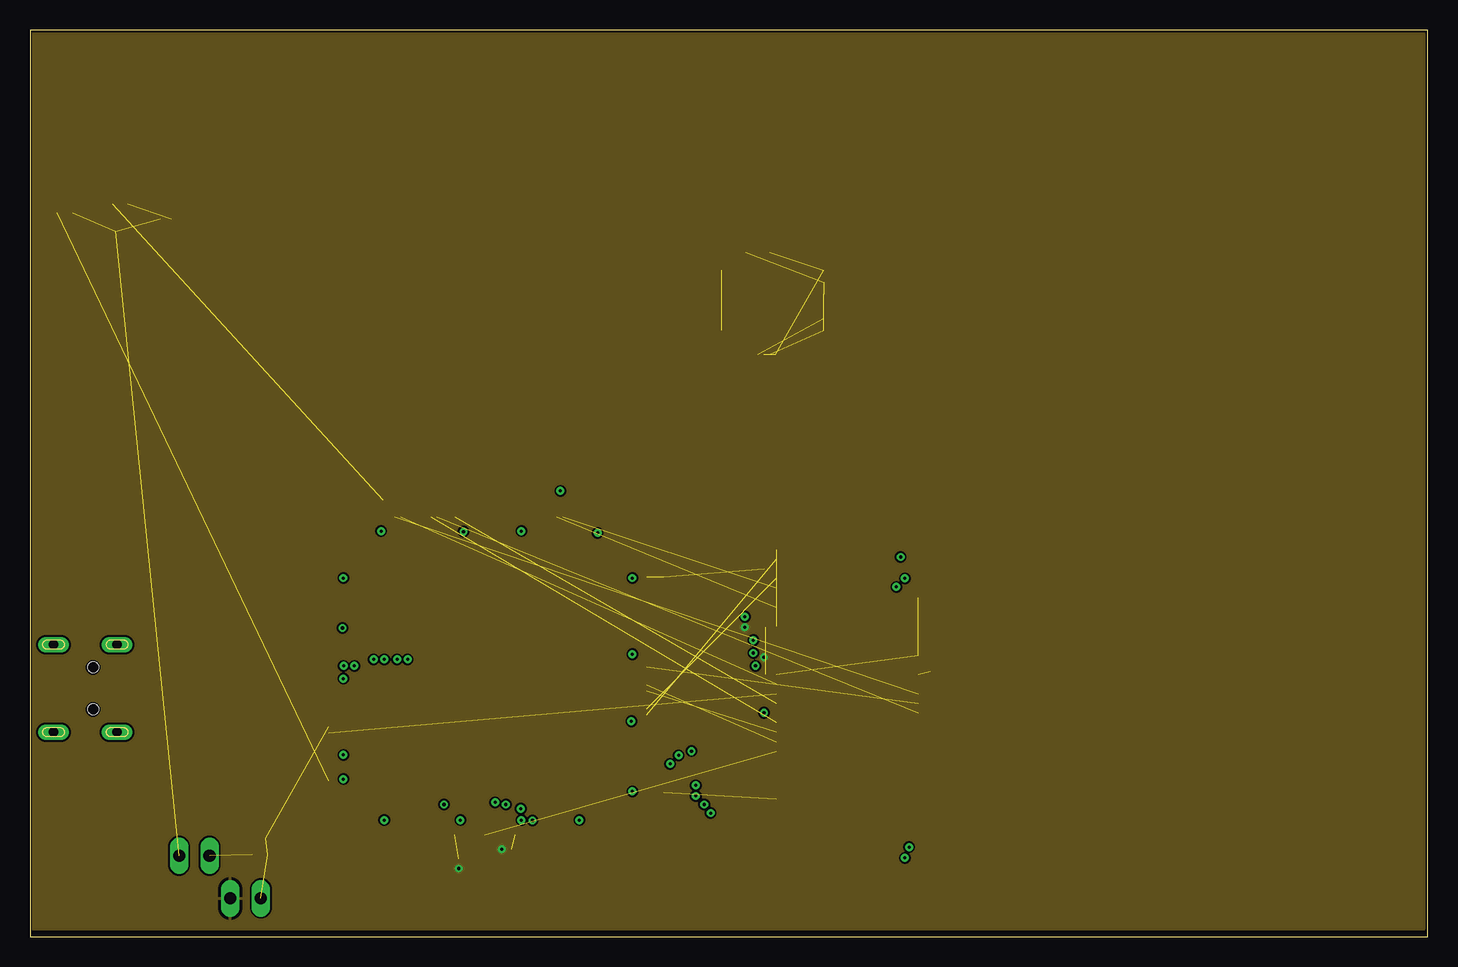
[diagram p7: board, inner layer Route2]
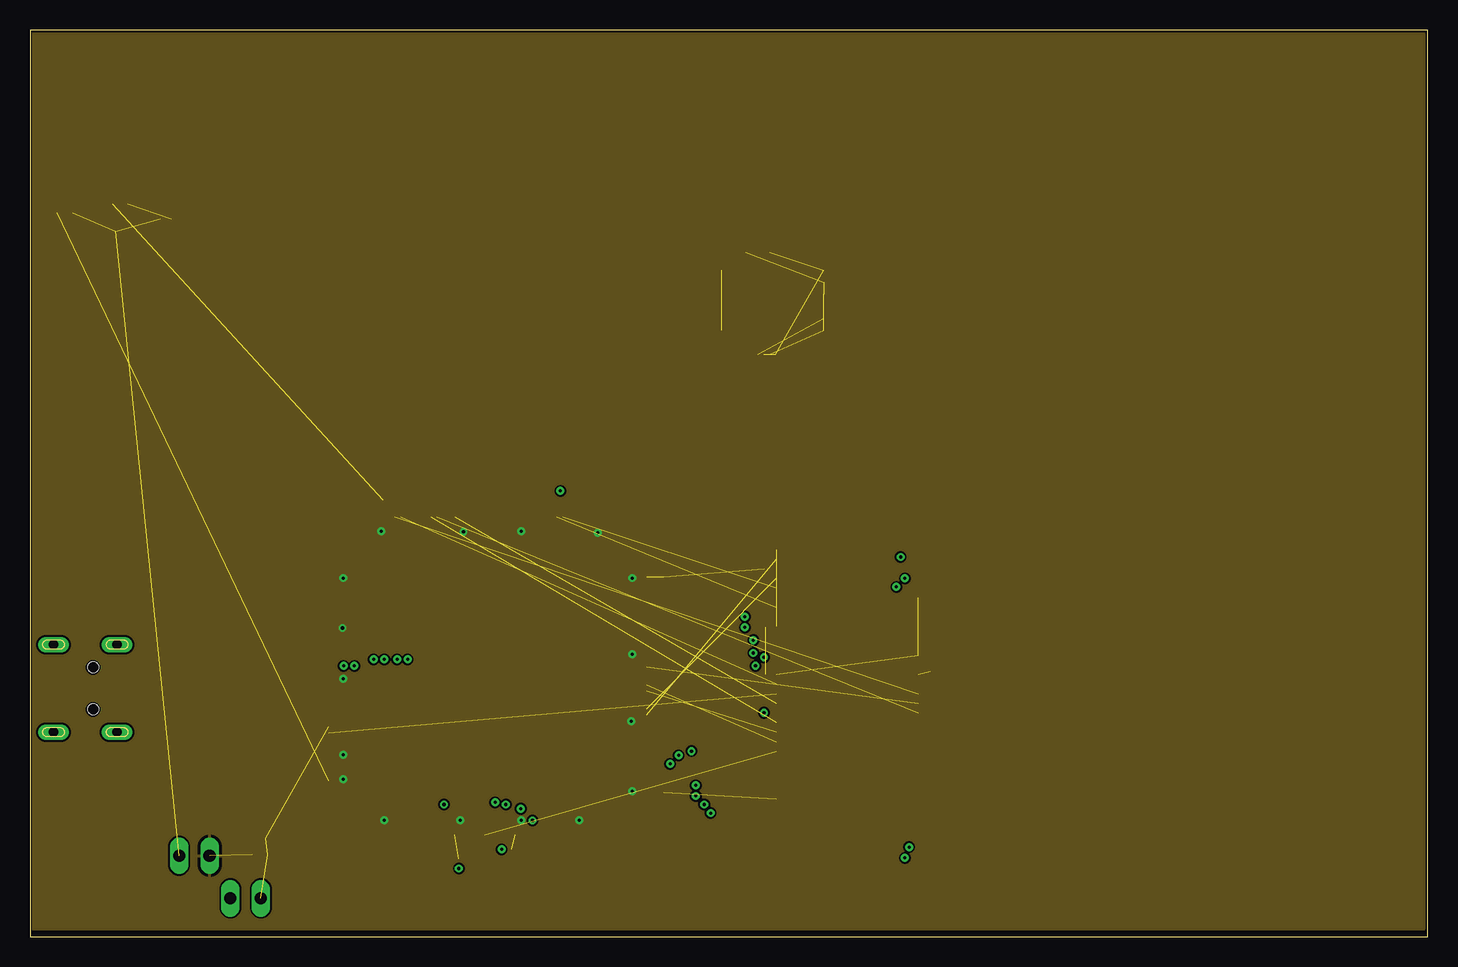
[diagram p8: board, inner layer Route3]
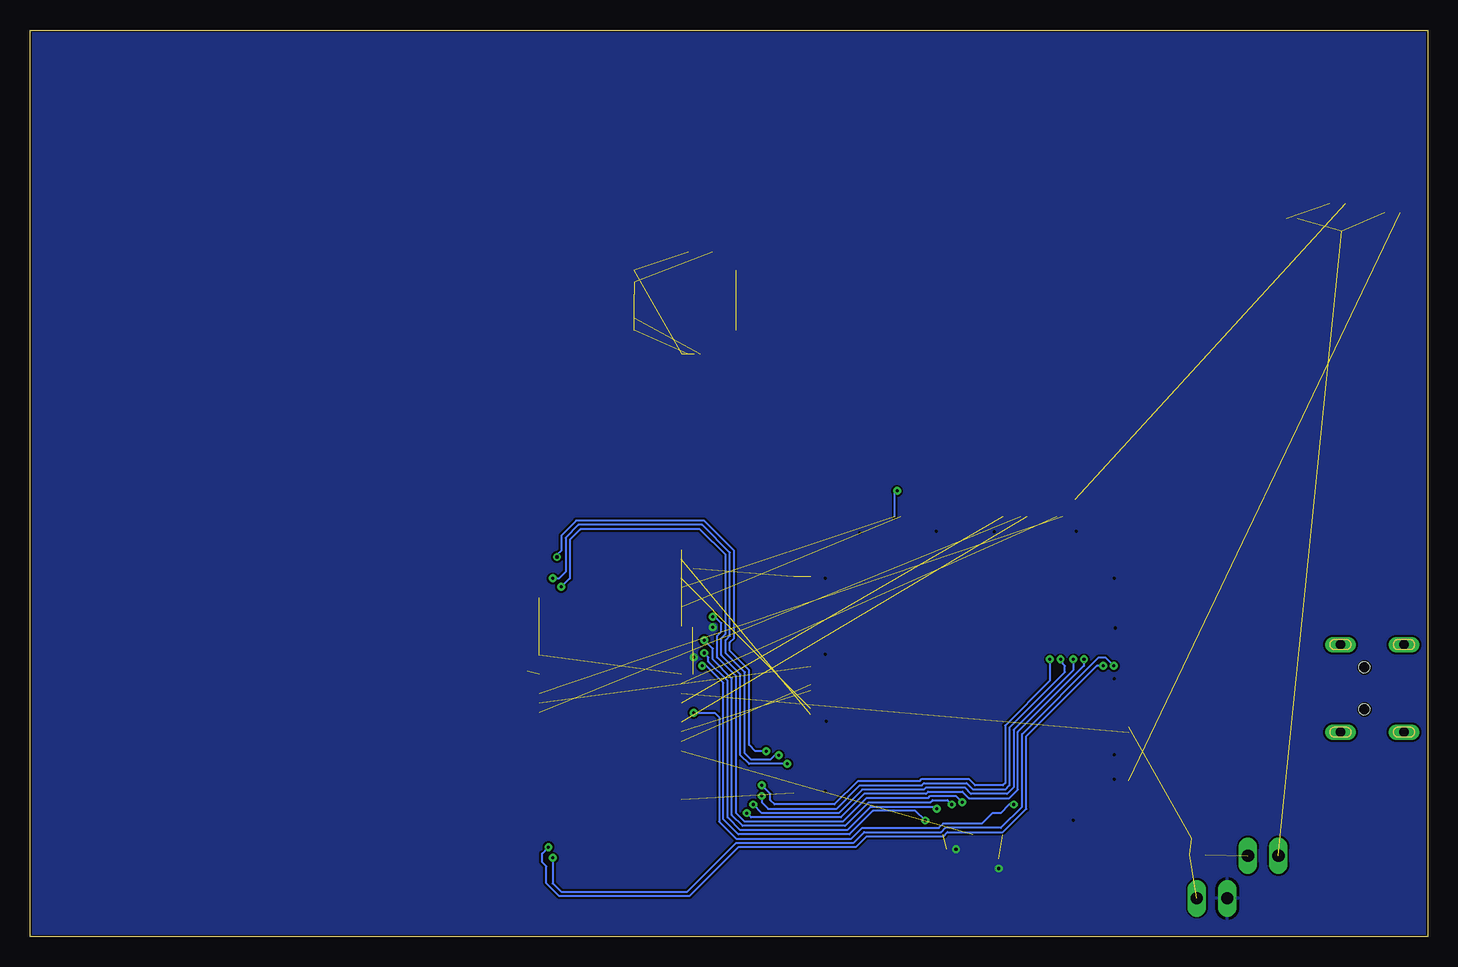
[diagram p9: board, bottom side, seen from below]

Size 116.46 x 75.56 mm. Coordinates in mm from the lower left corner, seen from the top.
Outline: 0,0 116.46,0 116.46,75.56 0,75.56 0,0
Copper layers (1*2*3*16): Top 0.035559375mm / dielectric 0.17018125mm / Route2 0.01778125mm / dielectric 47mil / Route3 0.01778125mm / dielectric 0.17018125mm / Bottom 0.035mm
Design rules "default *": minimum track width 6mil, minimum drill 10mil, track to track 6mil, track to pad 6mil, pad to pad 6mil, via to via 6mil, smd to smd 6mil, copper to edge 6mil, drill to drill 8mil, minimum pad ring 10mil, minimum via ring 8mil, stop-mask expansion 4mil, vias tented up to drill 11mil, thermal gap 10mil

### Footprints (pad centres in the part's own frame; a part is rotated, then mirrored left to right if it is on the bottom)
0402L3 = smd 0.4 x 0.6: P$1 -0.45,0; P$2 0.45,0
C0402 = smd 0.7 x 0.9: 1 -0.65,0; 2 0.65,0
LQFP-176 = smd 1.2 x 0.3: 1 -13.25,10.75; 2 -13.25,10.25; 3 -13.25,9.75; 4 -13.25,9.25; 5 -13.25,8.75; 6 -13.25,8.25; 7 -13.25,7.75; 8 -13.25,7.25; 9 -13.25,6.75; 10 -13.25,6.25; 11 -13.25,5.75; 12 -13.25,5.25; 13 -13.25,4.75; 14 -13.25,4.25; 15 -13.25,3.75; 16 -13.25,3.25; 17 -13.25,2.75; 18 -13.25,2.25; 19 -13.25,1.75; 20 -13.25,1.25; 21 -13.25,0.75; 22 -13.25,0.25; 23 -13.25,-0.25; 24 -13.25,-0.75; 25 -13.25,-1.25; 26 -13.25,-1.75; 27 -13.25,-2.25; 28 -13.25,-2.75; 29 -13.25,-3.25; 30 -13.25,-3.75; 31 -13.25,-4.25; 32 -13.25,-4.75; 33 -13.25,-5.25; 34 -13.25,-5.75; 35 -13.25,-6.25; 36 -13.25,-6.75; 37 -13.25,-7.25; 38 -13.25,-7.75; 39 -13.25,-8.25; 40 -13.25,-8.75; 41 -13.25,-9.25; 42 -13.25,-9.75; 43 -13.25,-10.25; 44 -13.25,-10.75; 89 13.25,-10.75; 90 13.25,-10.25; 91 13.25,-9.75; 92 13.25,-9.25; 93 13.25,-8.75; 94 13.25,-8.25; 95 13.25,-7.75; 96 13.25,-7.25; 97 13.25,-6.75; 98 13.25,-6.25; 99 13.25,-5.75; 100 13.25,-5.25; 101 13.25,-4.75; 102 13.25,-4.25; 103 13.25,-3.75; 104 13.25,-3.25; 105 13.25,-2.75; 106 13.25,-2.25; 107 13.25,-1.75; 108 13.25,-1.25; 109 13.25,-0.75; 110 13.25,-0.25; 111 13.25,0.25; 112 13.25,0.75; 113 13.25,1.25; 114 13.25,1.75; 115 13.25,2.25; 116 13.25,2.75; 117 13.25,3.25; 118 13.25,3.75; 119 13.25,4.25; 120 13.25,4.75; 121 13.25,5.25; 122 13.25,5.75; 123 13.25,6.25; 124 13.25,6.75; 125 13.25,7.25; 126 13.25,7.75; 127 13.25,8.25; 128 13.25,8.75; 129 13.25,9.25; 130 13.25,9.75; 131 13.25,10.25; 132 13.25,10.75 | smd 0.3 x 1.2: 45 -10.75,-13.25; 46 -10.25,-13.25; 47 -9.75,-13.25; 48 -9.25,-13.25; 49 -8.75,-13.25; 50 -8.25,-13.25; 51 -7.75,-13.25; 52 -7.25,-13.25; 53 -6.75,-13.25; 54 -6.25,-13.25; 55 -5.75,-13.25; 56 -5.25,-13.25; 57 -4.75,-13.25; 58 -4.25,-13.25; 59 -3.75,-13.25; 60 -3.25,-13.25; 61 -2.75,-13.25; 62 -2.25,-13.25; 63 -1.75,-13.25; 64 -1.25,-13.25; 65 -0.75,-13.25; 66 -0.25,-13.25; 67 0.25,-13.25; 68 0.75,-13.25; 69 1.25,-13.25; 70 1.75,-13.25; 71 2.25,-13.25; 72 2.75,-13.25; 73 3.25,-13.25; 74 3.75,-13.25; 75 4.25,-13.25; 76 4.75,-13.25; 77 5.25,-13.25; 78 5.75,-13.25; 79 6.25,-13.25; 80 6.75,-13.25; 81 7.25,-13.25; 82 7.75,-13.25; 83 8.25,-13.25; 84 8.75,-13.25; 85 9.25,-13.25; 86 9.75,-13.25; 87 10.25,-13.25; 88 10.75,-13.25; 133 10.75,13.25; 134 10.25,13.25; 135 9.75,13.25; 136 9.25,13.25; 137 8.75,13.25; 138 8.25,13.25; 139 7.75,13.25; 140 7.25,13.25; 141 6.75,13.25; 142 6.25,13.25; 143 5.75,13.25; 144 5.25,13.25; 145 4.75,13.25; 146 4.25,13.25; 147 3.75,13.25; 148 3.25,13.25; 149 2.75,13.25; 150 2.25,13.25; 151 1.75,13.25; 152 1.25,13.25; 153 0.75,13.25; 154 0.25,13.25; 155 -0.25,13.25; 156 -0.75,13.25; 157 -1.25,13.25; 158 -1.75,13.25; 159 -2.25,13.25; 160 -2.75,13.25; 161 -3.25,13.25; 162 -3.75,13.25; 163 -4.25,13.25; 164 -4.75,13.25; 165 -5.25,13.25; 166 -5.75,13.25; 167 -6.25,13.25; 168 -6.75,13.25; 169 -7.25,13.25; 170 -7.75,13.25; 171 -8.25,13.25; 172 -8.75,13.25; 173 -9.25,13.25; 174 -9.75,13.25; 175 -10.25,13.25; 176 -10.75,13.25
TSOP-2 = smd 0.9 x 0.49: 1 -5.93,10.4; 2 -5.93,9.6; 3 -5.93,8.8; 4 -5.93,8; 5 -5.93,7.2; 6 -5.93,6.4; 7 -5.93,5.6; 8 -5.93,4.8; 9 -5.93,4; 10 -5.93,3.2; 11 -5.93,2.4; 12 -5.93,1.6; 13 -5.93,0.8; 14 -5.93,0; 15 -5.93,-0.8; 16 -5.93,-1.6; 17 -5.93,-2.4; 18 -5.93,-3.2; 19 -5.93,-4; 20 -5.93,-4.8; 21 -5.93,-5.6; 22 -5.93,-6.4; 23 -5.93,-7.2; 24 -5.93,-8; 25 -5.93,-8.8; 26 -5.93,-9.6; 27 -5.93,-10.4; 28 5.93,-10.4; 29 5.93,-9.6; 30 5.93,-8.8; 31 5.93,-8; 32 5.93,-7.2; 33 5.93,-6.4; 34 5.93,-5.6; 35 5.93,-4.8; 36 5.93,-4; 37 5.93,-3.2; 38 5.93,-2.4; 39 5.93,-1.6; 40 5.93,-0.8; 41 5.93,0; 42 5.93,0.8; 43 5.93,1.6; 44 5.93,2.4; 45 5.93,3.2; 46 5.93,4; 47 5.93,4.8; 48 5.93,5.6; 49 5.93,6.4; 50 5.93,7.2; 51 5.93,8; 52 5.93,8.8; 53 5.93,9.6; 54 5.93,10.4
CHIP-LED0603 = smd 0.8 x 0.8: A 0,-0.75; C 0,0.75
CTS406 = smd 1.9 x 1.4: 1 -2.2,-1.2; 2 2.2,-1.2; 3 2.2,1.2; 4 -2.2,1.2
0402-RES = smd 0.7 x 0.9: 1 -0.65,0; 2 0.65,0
LQFP48 = smd 0.25 x 1: 1 -2.75,-4.25; 2 -2.25,-4.25; 3 -1.75,-4.25; 4 -1.25,-4.25; 5 -0.75,-4.25; 6 -0.25,-4.25; 7 0.25,-4.25; 8 0.75,-4.25; 9 1.25,-4.25; 10 1.75,-4.25; 11 2.25,-4.25; 12 2.75,-4.25; 25 2.75,4.25; 26 2.25,4.25; 27 1.75,4.25; 28 1.25,4.25; 29 0.75,4.25; 30 0.25,4.25; 31 -0.25,4.25; 32 -0.75,4.25; 33 -1.25,4.25; 34 -1.75,4.25; 35 -2.25,4.25; 36 -2.75,4.25 | smd 1 x 0.25: 13 4.25,-2.75; 14 4.25,-2.25; 15 4.25,-1.75; 16 4.25,-1.25; 17 4.25,-0.75; 18 4.25,-0.25; 19 4.25,0.25; 20 4.25,0.75; 21 4.25,1.25; 22 4.25,1.75; 23 4.25,2.25; 24 4.25,2.75; 37 -4.25,2.75; 38 -4.25,2.25; 39 -4.25,1.75; 40 -4.25,1.25; 41 -4.25,0.75; 42 -4.25,0.25; 43 -4.25,-0.25; 44 -4.25,-0.75; 45 -4.25,-1.25; 46 -4.25,-1.75; 47 -4.25,-2.25; 48 -4.25,-2.75
1X02 = drill 1.016 long: 1 -1.27,0; 2 1.27,0
UX60-MB-5S8 = smd 2 x 0.5: 1 8.65,1.6; 2 8.65,0.8; 3 8.65,0; 4 8.65,-0.8; 5 8.65,-1.6 | drill 0.8 long: M1 3.1,-3.65; M2 3.1,3.65; M3 8.4,3.65; M4 8.4,-3.65 | hole 0.9: 6.4,-1.75; 6.4,1.75

### Placement (x,y rotation side)
C1  16.51,24.31 270 top
C2  19.05,14.15 90 top
C9  53.26,30.02 0 top
C10  53.26,23.55 0 top
C11  53.26,17.96 0 top
C12  53.26,11.99 0 top
C13  23.04,25.45 180 top
C14  23.04,21.51 180 top
C15  23.04,14.88 180 top
C16  23.04,13.51 180 top
C17  45.87,6.93 270 top
C18  40.54,7.29 180 top
C19  35.74,6.93 270 top
C20  29.16,6.58 270 top
C21  21.77,30.02 180 top
C22  29.39,36.88 90 top
C23  35.86,36.88 90 top
C24  40.94,36.88 90 top
C25  47.42,36.88 90 top
C26  19.2,8.2 0 top
C27  11.3,59.82 180 top
C46  61.7,10.67 180 top
C47  75.39,28.27 0 top
C48  75.03,22.58 270 top
C49  61.16,21.34 270 top
C50  60.81,25.78 180 top
C51  60.72,30.67 180 top
C52  61.7,33.07 180 top
C55_VBAT  21.77,31.29 0 top
IC1  38.15,21.77 0 top
IC2  68.1,21.87 0 top
PWR_LED  0.94,14.5 180 top
Q1_STM  17.78,19.23 90 top
R1  21.59,17.96 0 top
R2_PWR_LED  9.88,16.64 270 top
R3  19.15,6.83 180 top
R4  2.92,60.32 180 top
R5  6.48,58.8 180 top
R6  7.49,61.09 180 top
U1  61.87,52.81 0 top
U$1  13.69,6.76 0 top
U$2  17.96,3.2 180 top
X1  -1.14,20.7 0 top

### Tracks (layer width: path | path; a pad name or v marks a point on that pad's centre or on a via)
3V3  (via drill 0.25 layers 1-4)  (10 unrouted)
  Top 0.152: v29.26,33.81 29.4,33.95 IC1.172 29.39,35.03 C22.P$1 | v40.95,33.81 40.9,33.85 IC1.149 40.95,35.06 C24.P$1 | v47.29,33.66 47.4,33.76 IC1.136 47.42,35.04 C25.P$1 | v50.19,12.12 50.29,12.02 IC1.91 51.43,11.99 C12.P$1 | v50.11,17.96 50.17,18.02 IC1.103 51.46,17.96 C11.P$1 | v50.19,23.55 50.22,23.52 IC1.114 51.43,23.55 C10.P$1 | IC1.127 50.31,30.02 v50.19,29.9 | v26.11,13.13 25.73,13.52 IC1.39 C16.P$1 | v26.11,15.16 25.96,15.02 IC1.36 23.82,15.02 C15.P$1 | v29.51,9.73 29.4,9.61 IC1.49 29.39,8.51 29.39,7.8 29.13,7.54 C20.P$1 | IC1.62 35.9,9.69 v35.87,9.73 | v40.95,9.73 40.9,9.68 IC1.72 40.9,7.35 C18.P$1 | v45.77,9.73 45.9,9.6 IC1.82 45.9,7.66 C17.P$1 | C13.P$1 24.83,25.45 IC1.15 25.82,25.52 v26.04,25.73 | C14.P$1 IC1.23 v26.11,21.52 v26.11,21.51 | C23.P$1 35.87,35.05 IC1.159 35.9,33.99 v36.12,33.77 | v26.11,29.9 25.99,30.02 IC1.6 23.16,30.02 | C21.P$1 23.16,30.02 | C55_VBAT.2 22.78,31.29 23.16,30.91 23.16,30.02
  Top 0.254: IC1.62 35.9,7.6 C19.P$1 | IC2.3 C51.P$1 | IC2.1 62.17,33.05 C52.P$1 | IC2.43 74.59,23.47 C48.P$1 | IC2.49 C47.P$1 | IC2.9 61.35,25.87 C50.P$1 | IC2.27 62.17,10.69 C46.P$1 | IC2.14 61.25,21.87 C49.P$1
  pour Route3 (isolate 0.152, rank 6): 116.2,75.26 0.13,75.26 0.13,0.63 116.2,0.63
AGND  (3 unrouted)
AVDD  (2 unrouted)
CVDD  (3 unrouted)
DGND  (5 unrouted)
GND  (via drill 0.25)  (3 unrouted)
  Top 0.254: C50.P$2 v59.56,25.78 | IC2.12 61.34,23.47 v61.16,23.29
  other vias: 39.29,7.29 35.74,5.69
  pour Bottom (isolate 0.152, rank 6): 116.28,75.39 0.18,75.39 0.18,0.18 116.28,0.18
  pour Route2 (isolate 0.152, rank 6): 116.2,75.26 0.13,75.26 0.13,0.63 116.2,0.63
  pour Top (isolate 0.152, rank 6): 0.18,75.39 0.18,0.18 116.28,0.18 116.28,75.39
IOVDD  (2 unrouted)
N$1
  Top 0.406: PWR_LED.A 9.15,15.25 R2_PWR_LED.2
N$2
  Top 0.152: R1.1 19.91,17.96 Q1_STM.1 18.98,14.87
  Top 0.203: 19.32,16.69 Q1_STM.1 | 18.98,14.87 C2.P$2
N$3  (3 unrouted)
N$4  (1 unrouted)
NRST  (3 unrouted)
OSC_IN
  Top 0.152: IC1.29 24.08,18.52 23.37,19.23 17.78,19.23 16.51,20.5 | C1.P$2 16.51,21.5
  Top 0.203: 16.51,20.5 16.51,21.36 Q1_STM.3 16.51,21.5
OSC_OUT
  Top 0.152: 24.84,17.96 R1.2
  Top 0.203: 24.84,17.96 IC1.30
PA0_WKUP  (1 unrouted)
PB5  (1 unrouted)
PB6  (1 unrouted)
PC0  (1 unrouted)
PD0  (via drill 0.25)  (1 unrouted)
  Top 0.152: v44.2,37.16 44.2,36.78 44.43,36.55 44.43,35.04 IC1.142
  Bottom 0.152: IC1.142 44.4,36.96 v44.2,37.16
PD1  (1 unrouted)
PD8  (via drill 0.25)
  Top 0.178: IC1.96 53.22,14.52 v53.34,14.4 | IC2.50 72.28,29.07 v72.19,29.16
  Bottom 0.178: v53.34,14.4 56.54,14.4 57.25,15.11 57.25,21.87 58.85,23.47 58.85,24.89 58.5,25.25 58.5,31.83 60.63,33.96 70.59,33.96 71.48,33.07 71.48,29.87 v72.19,29.16
PD9  (via drill 0.25)
  Top 0.178: IC1.97 52.89,15.02 52.98,15.11 v54.05,15.11 | IC2.51 v72.9,29.87
  Bottom 0.178: v54.05,15.11 54.41,15.11 54.76,14.76 56.36,14.76 56.9,15.29 56.9,22.05 58.5,23.65 58.5,24.71 58.14,25.07 58.14,32 60.45,34.32 70.76,34.32 71.83,33.25 71.83,30.4 72.37,29.87 v72.9,29.87
PD10  (via drill 0.25)
  Top 0.178: IC1.98 52.68,15.52 52.98,15.82 54.76,15.82 v55.12,15.47 | IC2.53 72.72,31.47 v72.54,31.65
  Bottom 0.178: v55.12,15.47 56.01,15.47 56.54,16 56.54,22.23 58.14,23.83 58.14,24.54 57.79,24.89 57.79,32.18 60.27,34.67 70.94,34.67 72.19,33.43 72.19,32.18 72.54,31.83 v72.54,31.65
PD14  (1 unrouted)
PD15  (1 unrouted)
PE0  (1 unrouted)
PE1  (1 unrouted)
PE7  (via drill 0.25)
  Top 0.178: IC1.68 38.9,11.06 v38.76,11.2 | 62.12,26.49 IC2.8 v59.56,26.67
  Bottom 0.178: v59.56,26.67 59.38,26.67 58.85,26.14 58.85,25.43 59.21,25.07 59.21,23.29 57.61,21.69 57.61,10.31 56.9,9.6 48.72,9.6 46.76,11.56 41.6,11.56 41.43,11.74 39.29,11.74 v38.76,11.2
PE8  (via drill 0.25)
  Top 0.178: IC1.69 39.4,10.78 v39.65,11.02 | v60.27,24.71 60.81,24.71 61.16,25.07 IC2.10
  Bottom 0.178: v60.27,24.71 59.56,24 59.56,23.11 57.96,21.51 57.96,10.13 57.07,9.25 48.54,9.25 46.58,11.2 41.43,11.2 41.25,11.38 40.01,11.38 v39.65,11.02
PE9  (via drill 0.25)
  Top 0.178: IC1.70 39.9,10.21 40.18,10.49 40.72,10.49 v40.89,10.67 | v60.27,23.65 60.81,24.18 62.18,24.18 IC2.11
  Bottom 0.178: v60.27,23.65 59.92,23.29 59.92,22.94 58.32,21.34 58.32,9.96 57.25,8.89 48.36,8.89 46.41,10.85 41.07,10.85 v40.89,10.67
PE10  (via drill 0.25)
  Top 0.178: IC1.73 41.4,9.22 v41.87,9.69 | IC2.13 62.18,22.58 v60.45,22.58
  Bottom 0.178: v60.45,22.58 60.1,22.58 58.67,21.16 58.67,9.78 57.43,8.53 48.18,8.53 46.23,10.49 42.67,10.49 v41.87,9.69
PE11
  Top 0.178: IC1.74 41.9,4.68 43.74,2.85 67.03,2.85 70.41,6.22 70.41,21.16 71.83,22.58 74.04,22.58 IC2.42
PE12
  Top 0.178: IC1.75 42.4,4.72 43.92,3.2 66.85,3.2 70.05,6.4 70.05,22.58 71.65,24.18 74.04,24.18 IC2.44
PE13
  Top 0.152: IC1.76
  Top 0.178: IC1.76 42.9,4.75 44.09,3.56 66.68,3.56 69.7,6.58 69.7,22.76 72.01,25.07 IC2.45
PE14
  Top 0.178: IC1.77 43.4,4.78 44.27,3.91 66.5,3.91 69.34,6.76 69.34,24 72.01,26.67 IC2.47
PE15
  Top 0.152: IC1.78
  Top 0.178: IC1.78 43.9,4.82 44.45,4.27 66.32,4.27 68.99,6.93 68.99,24.18 72.19,27.38 74.04,27.38 IC2.48
PF0  (via drill 0.25)
  Top 0.178: IC1.16 28.68,25.02 29.51,24.18 30.4,24.18 v31.47,23.11 | v55.47,12.62 56.18,12.62 57.07,11.74 57.43,11.74 57.79,11.38 58.32,11.38 61.52,14.58 62.08,14.58 IC2.23
  Bottom 0.178: v31.47,23.11 31.47,21.34 35.2,17.6 35.2,12.8 35.38,12.62 37.69,12.62 38.23,13.16 42.14,13.16 42.32,12.98 47.47,12.98 49.43,11.02 54.41,11.02 54.76,11.38 54.76,11.91 v55.47,12.62
PF1  (via drill 0.25)
  Top 0.178: IC2.24 61.34,13.87 58.5,11.02 57.61,11.02 57.25,11.38 56.9,11.38 56.36,11.91 55.65,11.91 v55.47,11.74 | v30.58,23.11 29.87,23.83 29.34,23.83 28.64,24.52 IC1.17
  Bottom 0.178: v55.47,11.74 55.47,11.2 54.94,10.67 49.25,10.67 47.29,12.62 42.14,12.62 41.96,12.8 38.4,12.8 37.87,12.27 35.2,12.27 34.85,12.62 34.85,17.42 30.23,22.05 30.23,22.58 30.4,22.76 30.4,22.94 v30.58,23.11
PF2  (via drill 0.25)
  Top 0.178: IC1.18 28.61,24.02 v29.51,23.11 | v56.18,11.02 57.07,11.02 57.43,10.67 58.67,10.67 61.07,13.07 IC2.25
  Bottom 0.178: v29.51,23.11 29.51,22.23 34.49,17.25 34.49,12.45 35.03,11.91 38.05,11.91 38.58,12.45 41.78,12.45 41.96,12.27 47.12,12.27 49.07,10.31 55.47,10.31 v56.18,11.02
PF3  (via drill 0.25)
  Top 0.178: IC1.19 25.65,23.52 25.78,23.65 28.09,23.65 v28.63,23.11 | v56.72,10.31 58.85,10.31 60.81,12.27 IC2.26
  Bottom 0.178: v28.63,23.11 28.63,22.58 34.14,17.07 34.14,12.27 34.85,11.56 38.23,11.56 38.76,12.09 41.6,12.09 41.78,11.91 46.94,11.91 48.9,9.96 56.36,9.96 v56.72,10.31
PF4  (via drill 0.25)
  Top 0.178: v73.25,7.47 72.9,7.82 72.9,11.91 73.25,12.27 IC2.29 | IC1.20 25.68,23.02 25.96,23.29 26.31,23.29 v27.03,22.58
  Bottom 0.178: v27.03,22.58 27.56,22.58 33.43,16.71 33.43,10.67 35.38,8.71 40.01,8.71 40.36,8.36 46.76,8.36 47.65,7.47 57.43,7.47 61.52,3.38 72.37,3.38 73.43,4.45 73.43,5.87 73.79,6.22 73.79,6.93 v73.25,7.47
PF5  (via drill 0.25)
  Top 0.178: IC2.30 73.34,13.07 72.54,12.27 72.54,6.93 v72.9,6.58 | IC1.21 26.07,22.52 v26.14,22.58
  Bottom 0.178: v72.9,6.58 72.9,4.45 72.19,3.73 61.7,3.73 57.61,7.82 47.83,7.82 46.94,8.71 40.54,8.71 40.18,9.07 35.56,9.07 33.78,10.85 33.78,16.89 27.38,23.29 26.85,23.29 v26.14,22.58
PF11  (via drill 0.25)
  Top 0.178: IC2.18 v61.16,18.67 | IC1.59 34.4,10.93 v34.49,11.02
  Bottom 0.178: v61.16,18.67 59.38,18.67 59.03,18.31 59.03,9.6 57.61,8.18 48.01,8.18 47.12,9.07 40.72,9.07 40.36,9.42 37.16,9.42 36.27,10.31 35.56,10.31 34.85,11.02 v34.49,11.02
PF12
  Top 0.178: IC1.60 34.9,7.52 34.32,6.93 34.32,3.02 36.27,1.07 67.92,1.07 72.19,5.33 72.19,12.8 73.25,13.87 IC2.31
PF13
  Top 0.178: IC1.63 36.4,4.67 39.65,1.42 67.74,1.42 71.83,5.51 71.83,13.51 72.9,14.58 74.04,14.58 IC2.32
PF14
  Top 0.178: IC1.64 36.9,4.7 39.83,1.78 67.56,1.78 71.48,5.69 71.48,14.4 72.54,15.47 IC2.33
PF15
  Top 0.178: IC1.65 37.4,4.74 40.01,2.13 67.39,2.13 71.12,5.87 71.12,15.11 72.19,16.18 74.04,16.18 IC2.34
PG0  (1 unrouted)
PG1
  Top 0.178: IC1.67 38.4,4.27 40.18,2.49 67.21,2.49 70.76,6.04 70.76,15.29 72.54,17.07 IC2.35
PG4  (1 unrouted)
PG5  (1 unrouted)
PG8  (1 unrouted)
PG15  (1 unrouted)
USB_5V
  Top 0.406: 9.5,22.3 9.78,22.02 9.78,17.39 R2_PWR_LED.1